# EasyEDA Pro project Solar-Module_25-3-9.epro

# Schematic Schematic1
Board Name: 44x24_5.5V; Create Date: 2024-12-06; Page Name: P1; Project Name: Solar-Module; Schematic Name: Schematic1; Update Date: 2024-12-10; Company: 嘉立创EDA; Page Size: A4; Version: V1.0
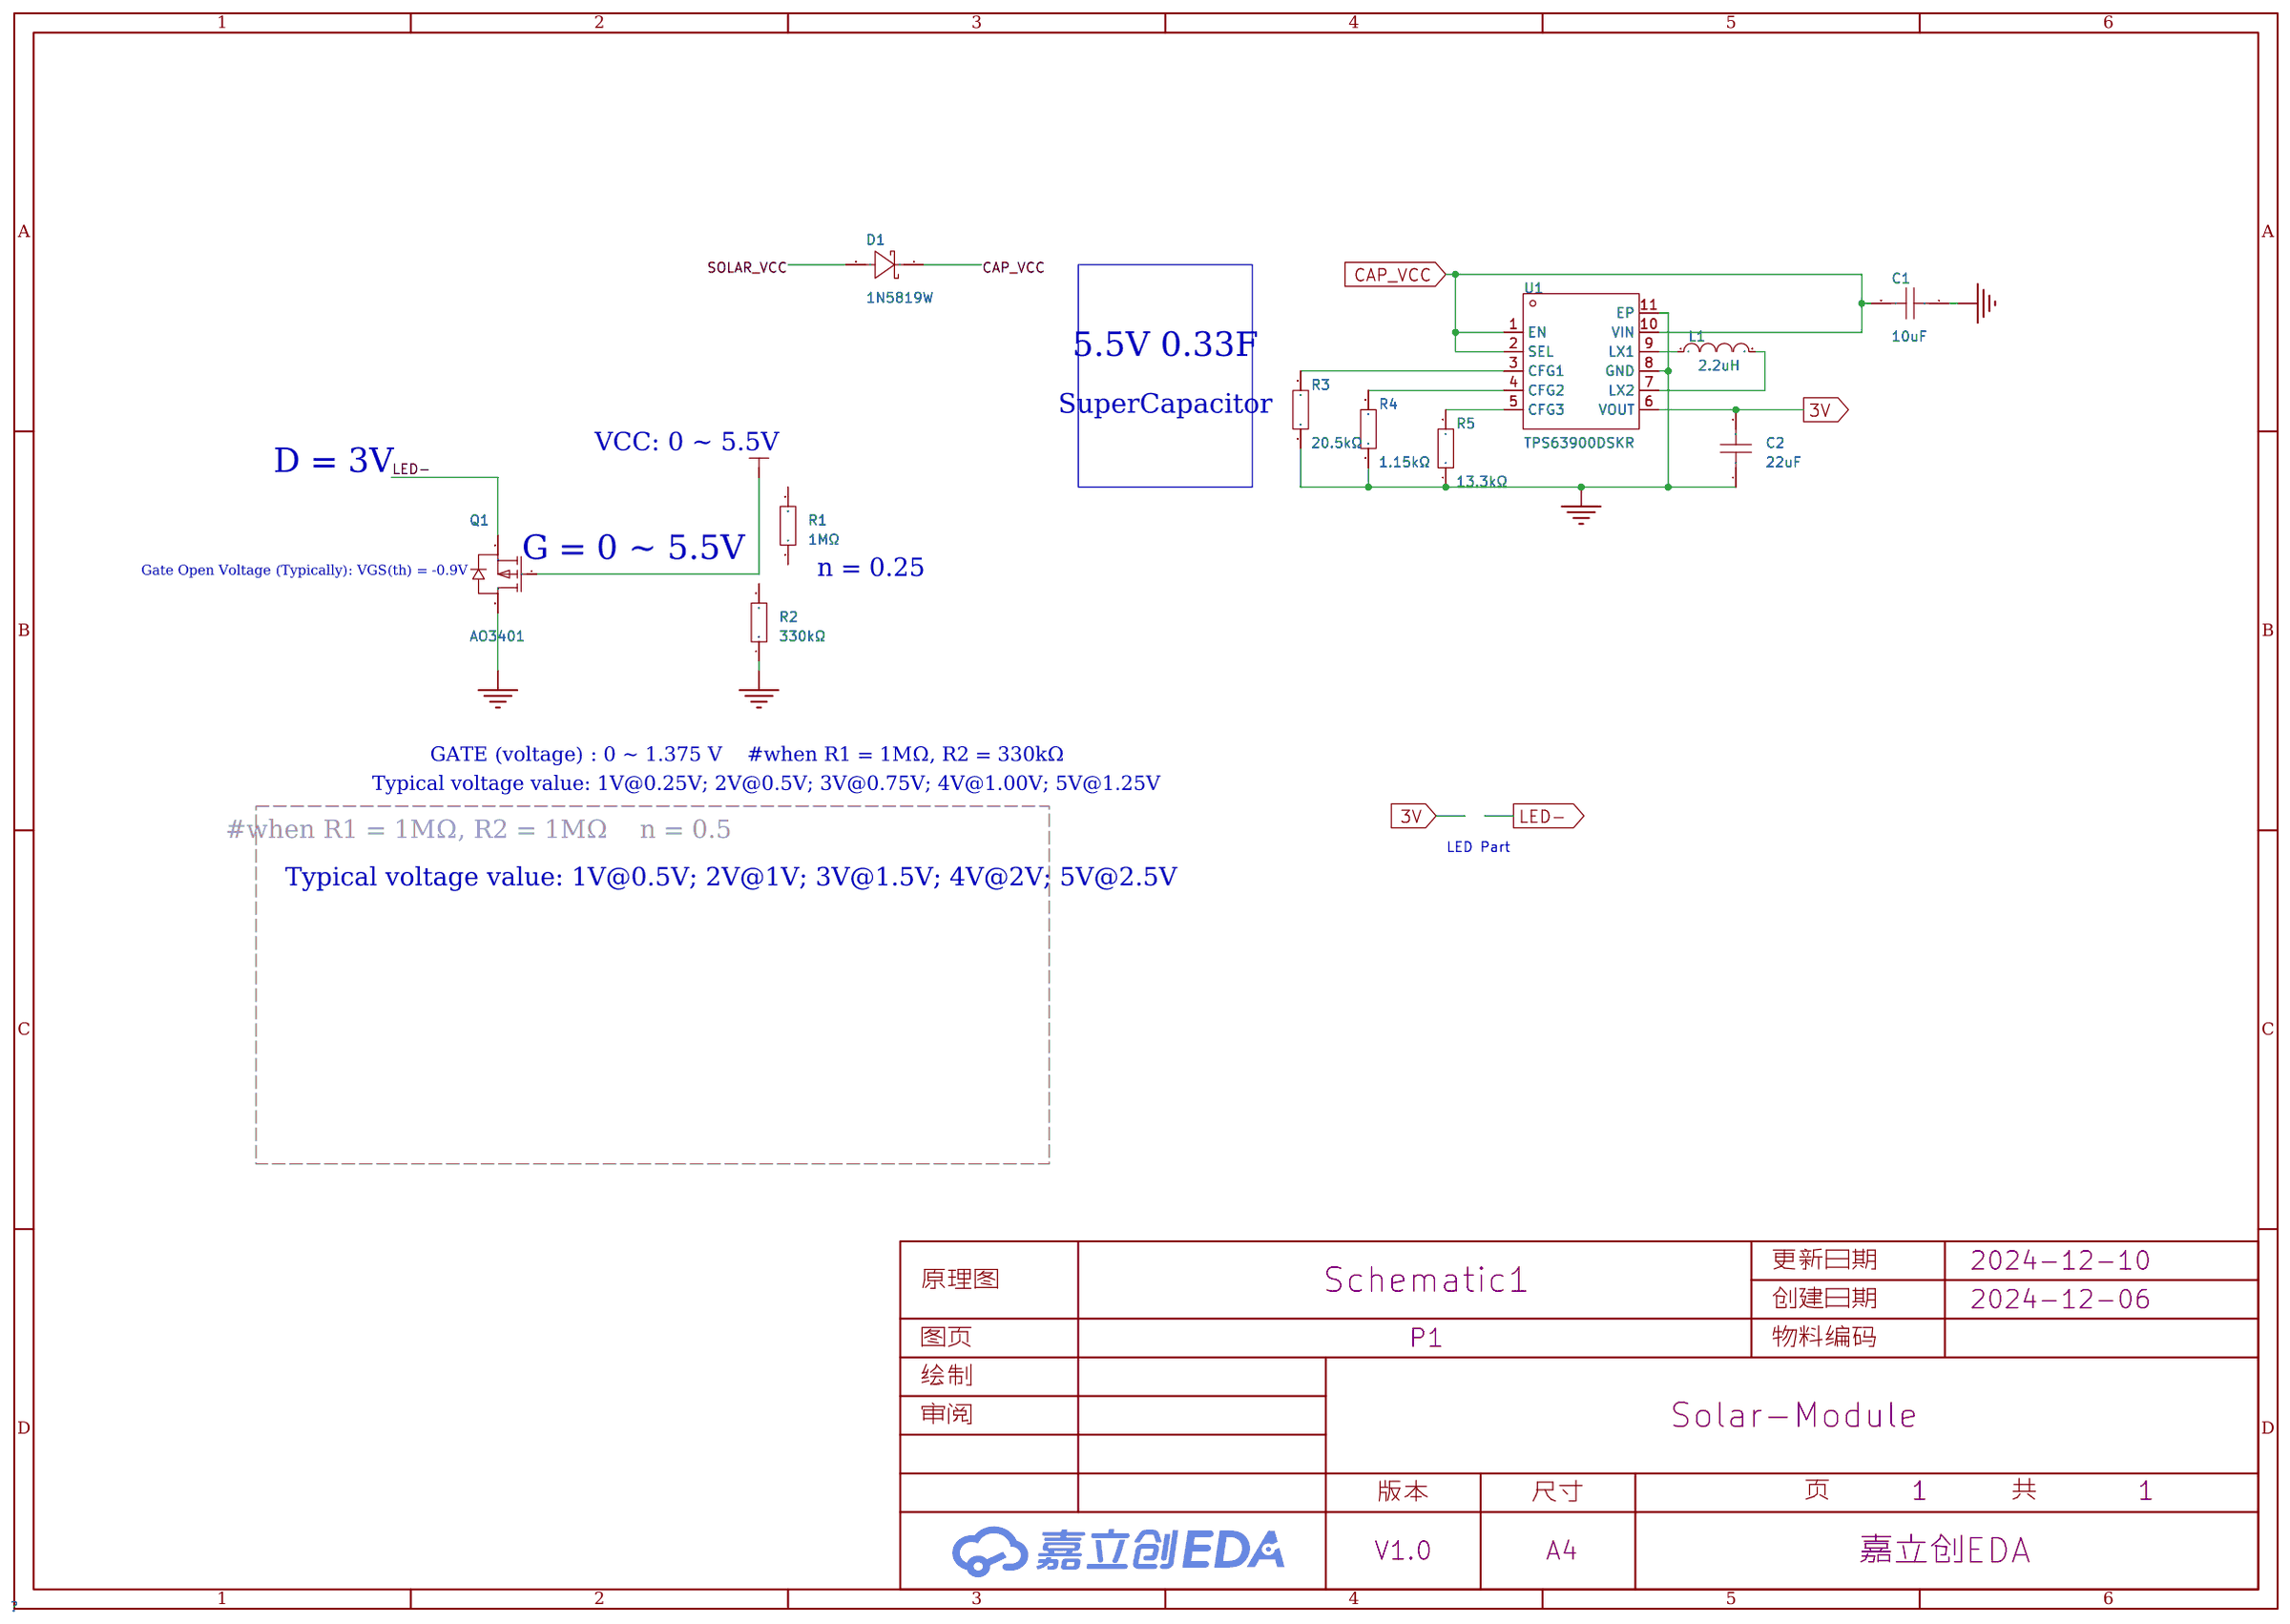
[diagram p0: schematic sheet]

## Parts
C1  10uF  [C0805]
C2  22uF  [C0805]
D1  1N5819W  [SOD-123_L2.8-W1.8-LS3.7-RD]
L1  2.2uH  [IND-SMD_L2.5-W2.0-VLS252012CX-150M]
Q1  AO3401  [SOT-23-3_L2.9-W1.4-P1.90-LS2.6-BR]
R1  1MΩ  [R0603]
R2  330kΩ  [R0603]
R3  20.5kΩ  [R0603]
R4  1.15kΩ  [R0603]
R5  13.3kΩ  [R0603]
U1  TPS63900DSKR  [WSON-10_L2.5-W2.5-W0.50-TL-EP]

## Library data of the parts
C1 = CL21A106KAYNNNE_C15850: 容值:10uF;精度:±10%;额定电压:25V;材质(温度系数):X5R;; LCSC Part Name: 10uF ±10% 25V; Supplier Part: C15850; Manufacturer: SAMSUNG(三星); Manufacturer Part: CL21A106KAYNNNE; Supplier Footprint: 0805; JLCPCB Part Class: 基础库; Datasheet: https://atta.szlcsc.com/upload/public/pdf/source/20160218/1457707763339.pdf; Supplier: LCSC; Tolerance: ±10%; Voltage Rated: 25V; Temperature Coefficient: X5R
C2 = CL21A226MAQNNNE: 容值:22uF;精度:±20%;额定电压:25V;材质(温度系数):X5R;; LCSC Part Name: 22uF ±20% 25V; Supplier Part: C45783; Manufacturer: SAMSUNG(三星); Supplier Footprint: 0805; JLCPCB Part Class: 基础库; Datasheet: https://atta.szlcsc.com/upload/public/pdf/source/20160218/1457707763339.pdf; Supplier: LCSC; Tolerance: ±20%; Voltage Rated: 25V; Temperature Coefficient: X5R
D1 = 1N5819W_C727115: 二极管配置:独立式;正向压降(Vf):900mV@3A;直流反向耐压(Vr):40V;整流电流:1A;; LCSC Part Name: 电压:40V 电流:1A; Supplier Part: C727115; Manufacturer: TWGMC(台湾迪嘉); Supplier Footprint: SOD-123; JLCPCB Part Class: 扩展库; Datasheet: https://atta.szlcsc.com/upload/public/pdf/source/20220518/A32FD9482A1BC542ED9C09095620CB64.pdf; Supplier: LCSC; Diode Configuration: 独立式; Forward Voltage (Vf@If): 900mV@3A; Reverse Voltage (Vr): 40V; Rectified Current: 1A; Reverse Leakage Current (Ir): 1mA
L1 = VLS252012CX-2R2M: 电感值:2.2uH;精度:±20%;额定电流:1.76A;; LCSC Part Name: 2.2uH ±20% 停产; Supplier Part: C307867; Manufacturer: TDK; Supplier Footprint: 2520; JLCPCB Part Class: Extended Part; Datasheet: https://atta.szlcsc.com/upload/public/pdf/source/20200727/C307867_825634F56BDB10F5BF665C183AF56530.pdf; Supplier: LCSC; Tolerance: ±20%; Rated Current: 1.76A; DC Resistance (DCR): 80mΩ
Q1 = AO3401_C727156: 类型:1个P沟道;漏源电压(Vdss):30V;连续漏极电流(Id):4.2A;导通电阻(RDS(on)@Vgs,Id):65mΩ@10V,4.2A;功率(Pd):350mW;阈值电压(Vgs(th)@Id):1.3V@250uA;; LCSC Part Name: 1个P沟道 耐压:30V 电流:4.2A; Supplier Part: C727156; Manufacturer: TWGMC(台湾迪嘉); Supplier Footprint: SOT-23; JLCPCB Part Class: 扩展库; Datasheet: https://atta.szlcsc.com/upload/public/pdf/source/20200827/C727156_6E081BBEEFBC6B8FEE164CB196B0AF30.pdf; Supplier: LCSC; Type: 1个P沟道; Drain Source Voltage (Vdss): 30V; Continuous Drain Current (Id): 4.2A; Drain Source On Resistance (RDS(on)@Vgs,Id): 65mΩ@10V,4.2A; Power Dissipation (Pd): 350mW; Gate Threshold Voltage (Vgs(th)@Id): 1.3V@250uA; Input Capacitance (Ciss@Vds): 954pF; Reverse Transfer Capacitance (Crss@Vds): 77pF; Operating Temperature: -55℃~+150℃
R1 = 0603WAF1004T5E: 电阻类型:厚膜电阻;阻值:1MΩ;精度:±1%;功率:100mW;最大工作电压:75V;温度系数:±100ppm/℃;; LCSC Part Name: 1MΩ ±1% 100mW 厚膜电阻; Supplier Part: C22935; Manufacturer: UNI-ROYAL(厚声); Supplier Footprint: 0603; JLCPCB Part Class: 基础库; Datasheet: https://atta.szlcsc.com/upload/public/pdf/source/20200306/C422600_1E6D84923E4A46A82E41ADD87F860B5C.pdf; Supplier: LCSC; Type: 厚膜电阻; Tolerance: ±1%; Power(Watts): 100mW; Overload Voltage (Max): 75V; Temperature Coefficient: ±100ppm/℃; Operating Temperature Range: -55℃~+155℃
R2 = 0603WAF3303T5E: 电阻类型:厚膜电阻;阻值:330kΩ;精度:±1%;功率:100mW;最大工作电压:75V;温度系数:±100ppm/℃;; LCSC Part Name: 330kΩ ±1% 100mW 厚膜电阻; Supplier Part: C23137; Manufacturer: UNI-ROYAL(厚声); Supplier Footprint: 0603; JLCPCB Part Class: 基础库; Datasheet: https://atta.szlcsc.com/upload/public/pdf/source/20200306/C422600_1E6D84923E4A46A82E41ADD87F860B5C.pdf; Supplier: LCSC; Type: 厚膜电阻; Tolerance: ±1%; Power(Watts): 100mW; Overload Voltage (Max): 75V; Temperature Coefficient: ±100ppm/℃; Operating Temperature Range: -55℃~+155℃
R3 = 0603WAF2052T5E: 电阻类型:厚膜电阻;阻值:20.5kΩ;精度:±1%;功率:100mW;最大工作电压:75V;温度系数:±100ppm/℃;; LCSC Part Name: 20.5kΩ ±1% 100mW 厚膜电阻; Supplier Part: C22910; Manufacturer: UNI-ROYAL(厚声); Supplier Footprint: 0603; JLCPCB Part Class: 扩展库; Datasheet: https://atta.szlcsc.com/upload/public/pdf/source/20200306/C422600_1E6D84923E4A46A82E41ADD87F860B5C.pdf; Supplier: LCSC; Type: 厚膜电阻; Tolerance: ±1%; Power(Watts): 100mW; Overload Voltage (Max): 75V; Temperature Coefficient: ±100ppm/℃; Operating Temperature Range: -55℃~+155℃
R4 = 0603WAF1151T5E: 电阻类型:厚膜电阻;阻值:1.15kΩ;精度:±1%;功率:100mW;最大工作电压:75V;温度系数:±100ppm/℃;; LCSC Part Name: 1.15kΩ ±1% 100mW 厚膜电阻; Supplier Part: C22834; Manufacturer: UNI-ROYAL(厚声); Supplier Footprint: 0603; JLCPCB Part Class: 扩展库; Datasheet: https://atta.szlcsc.com/upload/public/pdf/source/20200306/C422600_1E6D84923E4A46A82E41ADD87F860B5C.pdf; Supplier: LCSC; Type: 厚膜电阻; Tolerance: ±1%; Power(Watts): 100mW; Overload Voltage (Max): 75V; Temperature Coefficient: ±100ppm/℃; Operating Temperature Range: -55℃~+155℃
R5 = 0603WAF1332T5E: 电阻类型:厚膜电阻;阻值:13.3kΩ;精度:±1%;功率:100mW;最大工作电压:75V;温度系数:±100ppm/℃;; LCSC Part Name: 13.3kΩ ±1% 100mW 厚膜电阻; Supplier Part: C25952; Manufacturer: UNI-ROYAL(厚声); Supplier Footprint: 0603; JLCPCB Part Class: 扩展库; Datasheet: https://atta.szlcsc.com/upload/public/pdf/source/20200306/C422600_1E6D84923E4A46A82E41ADD87F860B5C.pdf; Supplier: LCSC; Type: 厚膜电阻; Tolerance: ±1%; Power(Watts): 100mW; Overload Voltage (Max): 75V; Temperature Coefficient: ±100ppm/℃; Operating Temperature Range: -55℃~+155℃
U1 = TPS63900DSKR: 输入电压:1.8V~5.5V;输出电流:400mA;; LCSC Part Name: 1.8V至5.5V,75nA超低静态电流同步升降压转换器; Supplier Part: C1518762; Manufacturer: TI(德州仪器); Supplier Footprint: WSON-10-EP(2.5x2.5); JLCPCB Part Class: 扩展库; Datasheet: https://www.ti.com/cn/lit/gpn/tps63900; Supplier: LCSC; Input Voltage: 1.8V~5.5V; Output Current: 400mA; Operating Temperature: -40℃~+125℃@(TJ); Synchronous Rectification: 是; Topology: 降压-升压式

## Nets
3V: C2.2 U1.6(VOUT)
GND: C1.1 C2.1 Q1.3(D) R2.1 R3.1 R4.1 R5.1 U1.8(GND) U1.11(EP)
CAP_VCC: C1.2 D1.1(C) U1.1(EN) U1.2(SEL) U1.10(VIN)
LED-: Q1.2(S)
SOLAR_VCC: D1.2(A) Q1.1(G)
$1N1286: L1.1 U1.9(LX1)
$1N1290: L1.2 U1.7(LX2)
$1N1305: R3.2 U1.3(CFG1)
$1N1309: R4.2 U1.4(CFG2)
$1N1314: R5.2 U1.5(CFG3)

Not connected (* = marked no-connect by the designer): R1 1 2; R2 2

## Notes on the sheet
- 5.5V 0.33F
- SuperCapacitor
- VCC: 0 ~ 5.5V
- D = 3V
- G = 0 ~ 5.5V
- Gate Open Voltage (Typically): VGS(th) = -0.9V
- n = 0.25
- GATE (voltage) : 0 ~ 1.375 V    #when R1 = 1MΩ, R2 = 330kΩ
- Typical voltage value: 1V@0.25V; 2V@0.5V; 3V@0.75V; 4V@1.00V; 5V@1.25V
- #when R1 = 1MΩ, R2 = 1MΩ    n = 0.5
- LED Part
- Typical voltage value: 1V@0.5V; 2V@1V; 3V@1.5V; 4V@2V; 5V@2.5V

# Schematic Schematic1_2
Board Name: 44x24_5.5V_(Beta.2); Create Date: 2024-12-16; Page Name: P1; Project Name: Solar-Module; Schematic Name: Schematic1_2; Update Date: 2024-12-19; Company: 嘉立创EDA; Page Size: A4; Version: V1.0
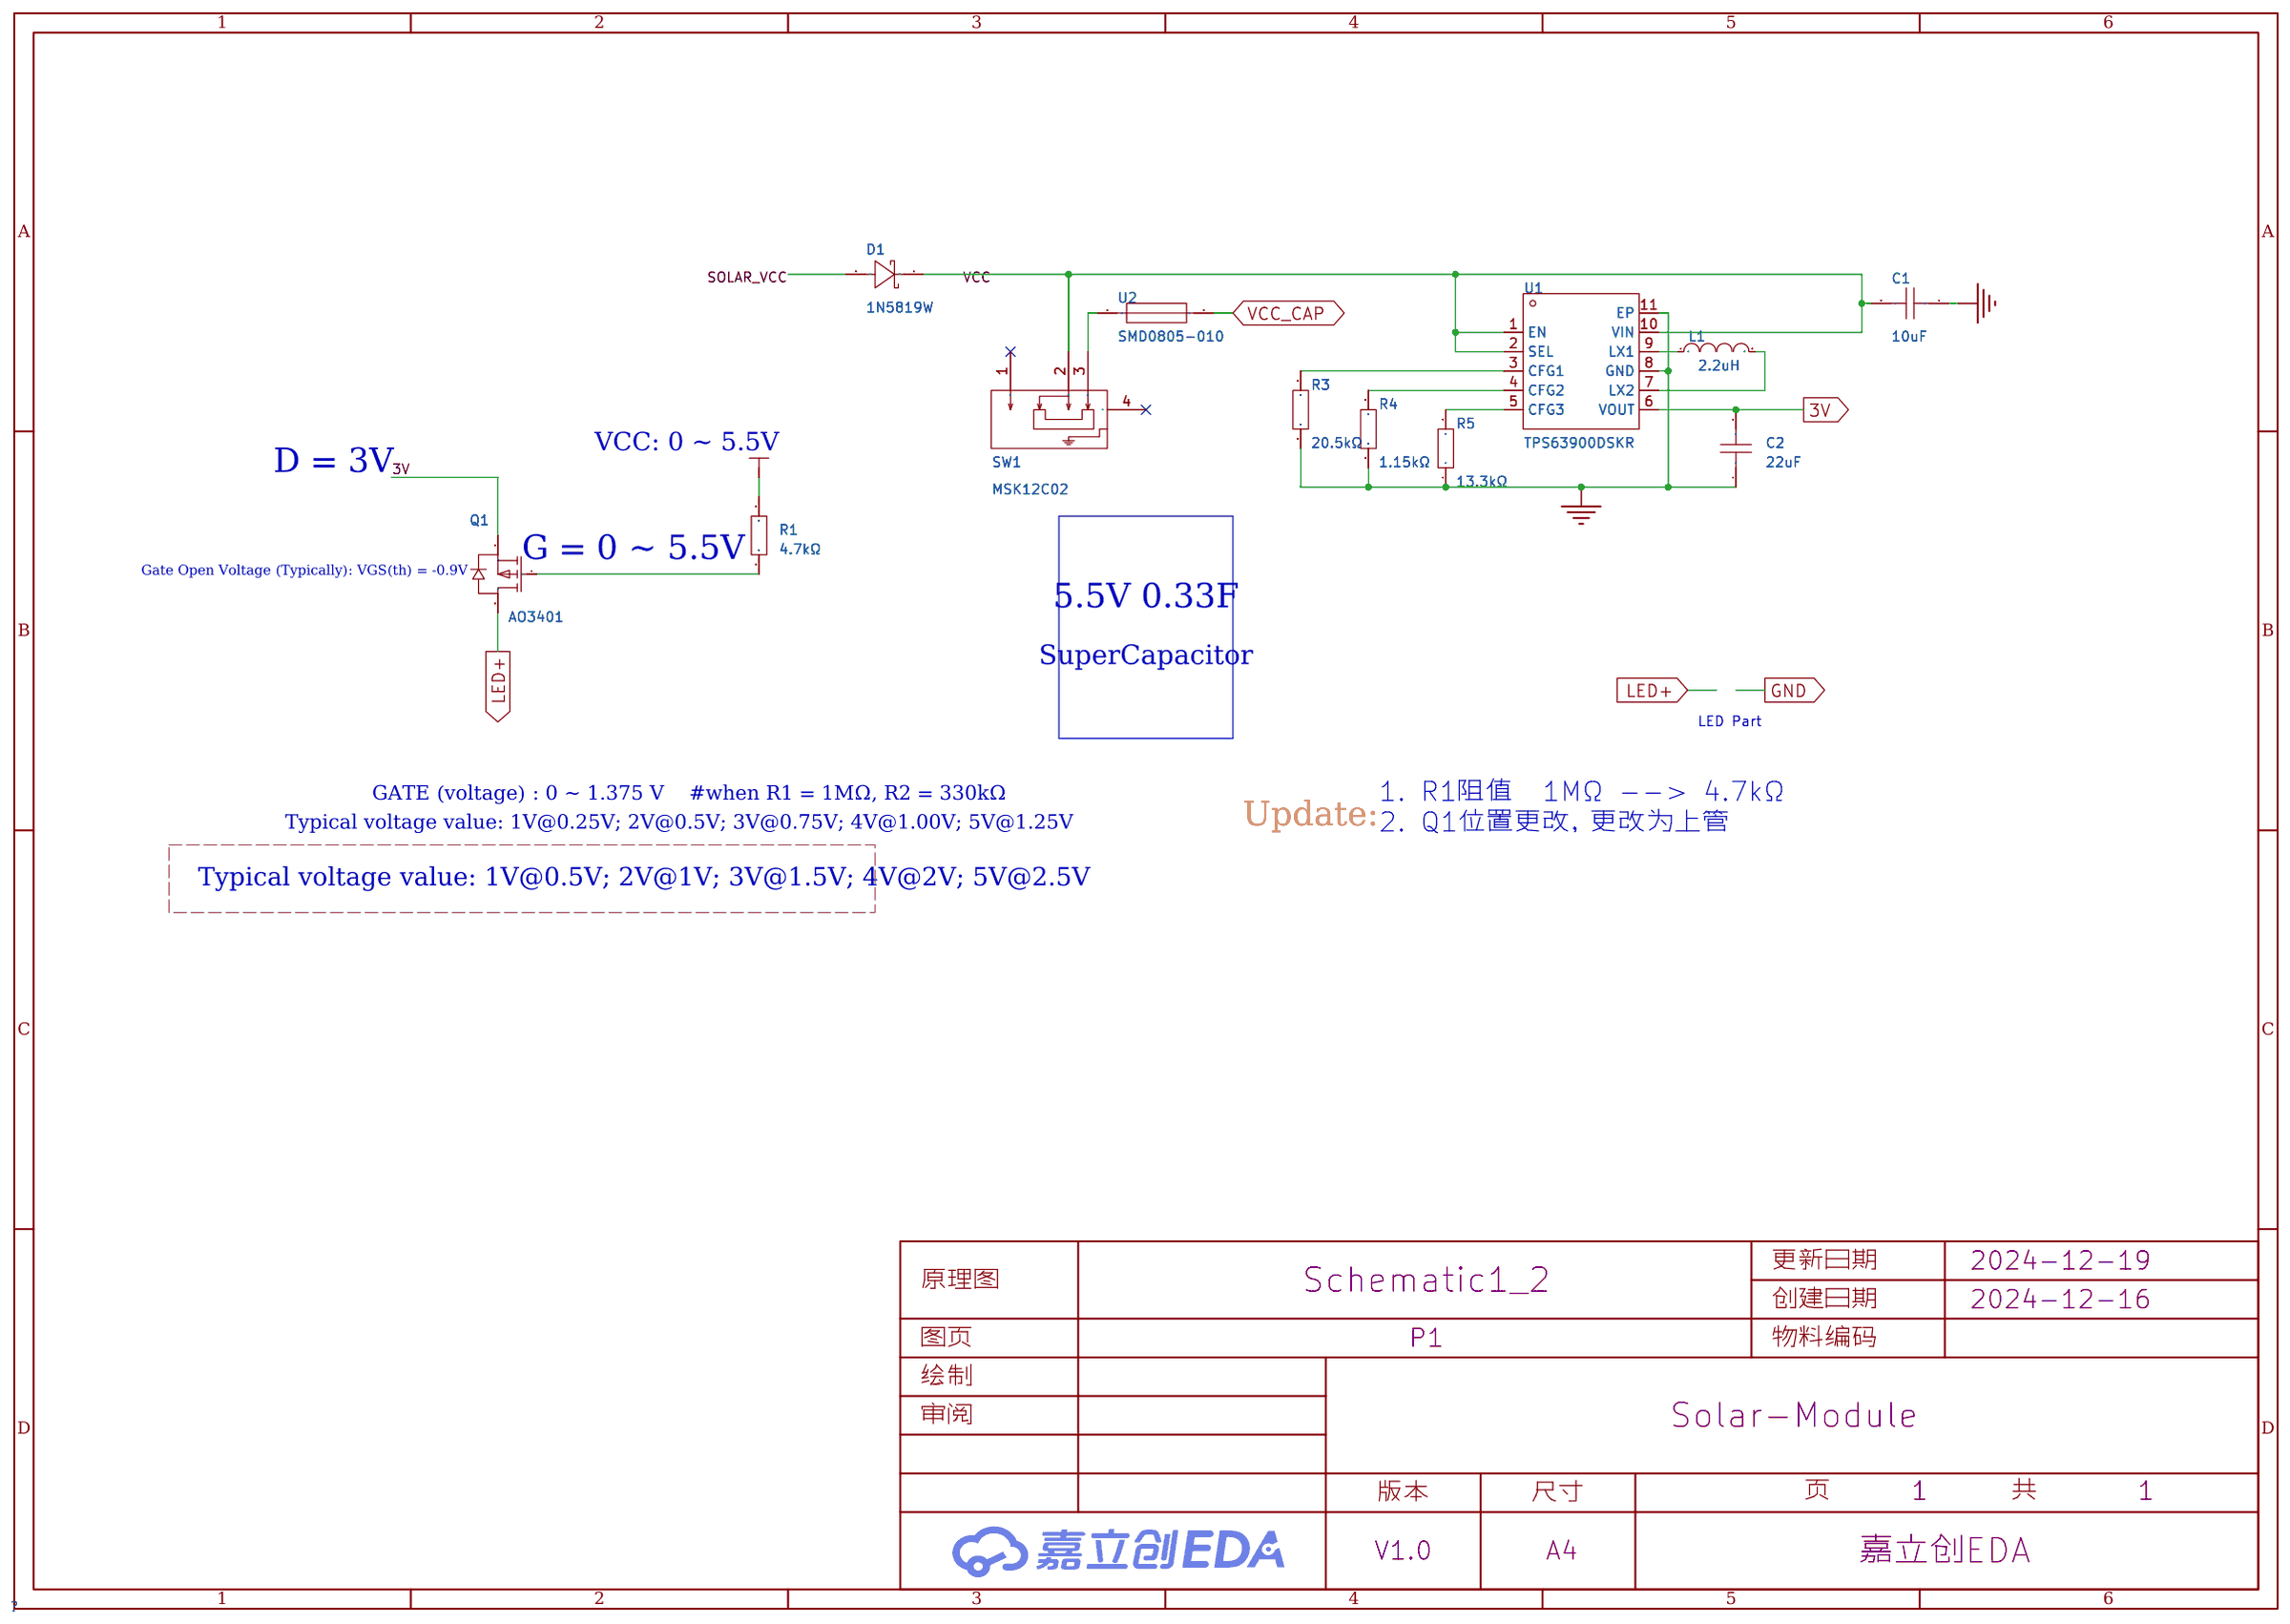
[diagram p1: schematic sheet]

## Parts
C1  10uF  [C0805]
C2  22uF  [C0805]
D1  1N5819W  [SOD-123_L2.8-W1.8-LS3.7-RD]
L1  2.2uH  [IND-SMD_L2.5-W2.0-VLS252012CX-150M]
Q1  AO3401  [SOT-23-3_L2.9-W1.4-P1.90-LS2.6-BR]
R1  4.7kΩ  [R0603]
R3  20.5kΩ  [R0603]
R4  1.15kΩ  [R0603]
R5  13.3kΩ  [R0603]
SW1  MSK12C02  [SW-TH_MSK12C02]
U1  TPS63900DSKR  [WSON-10_L2.5-W2.5-W0.50-TL-EP]
U2  SMD0805-010  [F0805]

## Library data of the parts
C1 = CL21A106KAYNNNE_C15850: 容值:10uF;精度:±10%;额定电压:25V;材质(温度系数):X5R;; LCSC Part Name: 10uF ±10% 25V; Supplier Part: C15850; Manufacturer: SAMSUNG(三星); Manufacturer Part: CL21A106KAYNNNE; Supplier Footprint: 0805; JLCPCB Part Class: 基础库; Datasheet: https://atta.szlcsc.com/upload/public/pdf/source/20160218/1457707763339.pdf; Supplier: LCSC; Tolerance: ±10%; Voltage Rated: 25V; Temperature Coefficient: X5R
C2 = CL21A226MAQNNNE: 容值:22uF;精度:±20%;额定电压:25V;材质(温度系数):X5R;; LCSC Part Name: 22uF ±20% 25V; Supplier Part: C45783; Manufacturer: SAMSUNG(三星); Supplier Footprint: 0805; JLCPCB Part Class: 基础库; Datasheet: https://atta.szlcsc.com/upload/public/pdf/source/20160218/1457707763339.pdf; Supplier: LCSC; Tolerance: ±20%; Voltage Rated: 25V; Temperature Coefficient: X5R
D1 = 1N5819W_C727115: 二极管配置:独立式;正向压降(Vf):900mV@3A;直流反向耐压(Vr):40V;整流电流:1A;; LCSC Part Name: 电压:40V 电流:1A; Supplier Part: C727115; Manufacturer: TWGMC(台湾迪嘉); Supplier Footprint: SOD-123; JLCPCB Part Class: 扩展库; Datasheet: https://atta.szlcsc.com/upload/public/pdf/source/20220518/A32FD9482A1BC542ED9C09095620CB64.pdf; Supplier: LCSC; Diode Configuration: 独立式; Forward Voltage (Vf@If): 900mV@3A; Reverse Voltage (Vr): 40V; Rectified Current: 1A; Reverse Leakage Current (Ir): 1mA
L1 = VLS252012CX-2R2M: 电感值:2.2uH;精度:±20%;额定电流:1.76A;; LCSC Part Name: 2.2uH ±20% 停产; Supplier Part: C307867; Manufacturer: TDK; Supplier Footprint: 2520; JLCPCB Part Class: Extended Part; Datasheet: https://atta.szlcsc.com/upload/public/pdf/source/20200727/C307867_825634F56BDB10F5BF665C183AF56530.pdf; Supplier: LCSC; Tolerance: ±20%; Rated Current: 1.76A; DC Resistance (DCR): 80mΩ
Q1 = AO3401_C727156: 类型:1个P沟道;漏源电压(Vdss):30V;连续漏极电流(Id):4.2A;导通电阻(RDS(on)@Vgs,Id):65mΩ@10V,4.2A;功率(Pd):350mW;阈值电压(Vgs(th)@Id):1.3V@250uA;; LCSC Part Name: 1个P沟道 耐压:30V 电流:4.2A; Supplier Part: C727156; Manufacturer: TWGMC(台湾迪嘉); Supplier Footprint: SOT-23; JLCPCB Part Class: 扩展库; Datasheet: https://atta.szlcsc.com/upload/public/pdf/source/20200827/C727156_6E081BBEEFBC6B8FEE164CB196B0AF30.pdf; Supplier: LCSC; Type: 1个P沟道; Drain Source Voltage (Vdss): 30V; Continuous Drain Current (Id): 4.2A; Drain Source On Resistance (RDS(on)@Vgs,Id): 65mΩ@10V,4.2A; Power Dissipation (Pd): 350mW; Gate Threshold Voltage (Vgs(th)@Id): 1.3V@250uA; Input Capacitance (Ciss@Vds): 954pF; Reverse Transfer Capacitance (Crss@Vds): 77pF; Operating Temperature: -55℃~+150℃
R1 = 0603WAF4701T5E: 电阻类型:厚膜电阻;阻值:4.7kΩ;精度:±1%;功率:100mW;最大工作电压:75V;温度系数:±100ppm/℃;; LCSC Part Name: 4.7kΩ ±1% 100mW 厚膜电阻; Supplier Part: C23162; Manufacturer: UNI-ROYAL(厚声); Supplier Footprint: 0603; JLCPCB Part Class: Basic Part; Datasheet: https://atta.szlcsc.com/upload/public/pdf/source/20200306/C422600_1E6D84923E4A46A82E41ADD87F860B5C.pdf; Supplier: LCSC; Type: 厚膜电阻; Tolerance: ±1%; Power(Watts): 100mW; Overload Voltage (Max): 75V; Temperature Coefficient: ±100ppm/℃; Operating Temperature Range: -55℃~+155℃
R3 = 0603WAF2052T5E: 电阻类型:厚膜电阻;阻值:20.5kΩ;精度:±1%;功率:100mW;最大工作电压:75V;温度系数:±100ppm/℃;; LCSC Part Name: 20.5kΩ ±1% 100mW 厚膜电阻; Supplier Part: C22910; Manufacturer: UNI-ROYAL(厚声); Supplier Footprint: 0603; JLCPCB Part Class: 扩展库; Datasheet: https://atta.szlcsc.com/upload/public/pdf/source/20200306/C422600_1E6D84923E4A46A82E41ADD87F860B5C.pdf; Supplier: LCSC; Type: 厚膜电阻; Tolerance: ±1%; Power(Watts): 100mW; Overload Voltage (Max): 75V; Temperature Coefficient: ±100ppm/℃; Operating Temperature Range: -55℃~+155℃
R4 = 0603WAF1151T5E: 电阻类型:厚膜电阻;阻值:1.15kΩ;精度:±1%;功率:100mW;最大工作电压:75V;温度系数:±100ppm/℃;; LCSC Part Name: 1.15kΩ ±1% 100mW 厚膜电阻; Supplier Part: C22834; Manufacturer: UNI-ROYAL(厚声); Supplier Footprint: 0603; JLCPCB Part Class: 扩展库; Datasheet: https://atta.szlcsc.com/upload/public/pdf/source/20200306/C422600_1E6D84923E4A46A82E41ADD87F860B5C.pdf; Supplier: LCSC; Type: 厚膜电阻; Tolerance: ±1%; Power(Watts): 100mW; Overload Voltage (Max): 75V; Temperature Coefficient: ±100ppm/℃; Operating Temperature Range: -55℃~+155℃
R5 = 0603WAF1332T5E: 电阻类型:厚膜电阻;阻值:13.3kΩ;精度:±1%;功率:100mW;最大工作电压:75V;温度系数:±100ppm/℃;; LCSC Part Name: 13.3kΩ ±1% 100mW 厚膜电阻; Supplier Part: C25952; Manufacturer: UNI-ROYAL(厚声); Supplier Footprint: 0603; JLCPCB Part Class: 扩展库; Datasheet: https://atta.szlcsc.com/upload/public/pdf/source/20200306/C422600_1E6D84923E4A46A82E41ADD87F860B5C.pdf; Supplier: LCSC; Type: 厚膜电阻; Tolerance: ±1%; Power(Watts): 100mW; Overload Voltage (Max): 75V; Temperature Coefficient: ±100ppm/℃; Operating Temperature Range: -55℃~+155℃
SW1 = MSK12C02: 电路结构:单刀双掷;安装方式:卧贴;开关颜色:-;额定电流(DC):50mA;额定电压(DC):12V;额定电流(AC):-;额定电压(AC):-;机械寿命:1万次;; LCSC Part Name: 两档侧拨贴片 7脚 滑动开关; Supplier Part: C431540; Manufacturer: SHOU HAN(首韩); Supplier Footprint: SMD; JLCPCB Part Class: 扩展库; Datasheet: https://atta.szlcsc.com/upload/public/pdf/source/20190925/C431540_89155AEF0758B9AD1B2D805F83FB12E3.pdf; Supplier: LCSC; Circuit: 单刀双掷; Pin Style: SMD接片; Switch Length: 8mm; Switch Width: 2.8mm; Switch Height: 1.4mm; Mounting Style: 卧贴; Current Rating (DC): 50mA; Voltage Rating (DC): 12V; Mechanical Life: 1万次; Operating Temperature: -20℃~+70℃
U1 = TPS63900DSKR: 输入电压:1.8V~5.5V;输出电流:400mA;; LCSC Part Name: 1.8V至5.5V,75nA超低静态电流同步升降压转换器; Supplier Part: C1518762; Manufacturer: TI(德州仪器); Supplier Footprint: WSON-10-EP(2.5x2.5); JLCPCB Part Class: 扩展库; Datasheet: https://www.ti.com/cn/lit/gpn/tps63900; Supplier: LCSC; Input Voltage: 1.8V~5.5V; Output Current: 400mA; Operating Temperature: -40℃~+125℃@(TJ); Synchronous Rectification: 是; Topology: 降压-升压式
U2 = SMD0805-010: 最大电压:15V;最大电流:100A;保持电流:100mA;跳闸电流:300mA;; LCSC Part Name: 15V 100mA 0805自恢复; Supplier Part: C70054; Manufacturer: 台湾陆海; Supplier Footprint: 0805; JLCPCB Part Class: Extended Part; Datasheet: https://atta.szlcsc.com/upload/public/pdf/source/20160331/1459396375918.pdf; Supplier: LCSC; Operating Voltage (Max): 15V; Current Rating (Max): 100A; Hold Current: 100mA; Trip Current: 300mA

## Nets
3V: C2.2 Q1.2(S) U1.6(VOUT)
GND: C1.1 C2.1 R3.1 R4.1 R5.1 U1.8(GND) U1.11(EP)
VCC: C1.2 D1.1(C) SW1.2 U1.1(EN) U1.2(SEL) U1.10(VIN)
VCC_CAP: U2.2
LED+: Q1.3(D)
SOLAR_VCC: D1.2(A) R1.2
$1N1286: L1.1 U1.9(LX1)
$1N1290: L1.2 U1.7(LX2)
$1N1305: R3.2 U1.3(CFG1)
$1N1309: R4.2 U1.4(CFG2)
$1N1314: R5.2 U1.5(CFG3)
$1N3593: Q1.1(G) R1.1
$1N4546: SW1.3 U2.1

Not connected (* = marked no-connect by the designer): SW1 1* 4*

## Notes on the sheet
- VCC: 0 ~ 5.5V
- D = 3V
- G = 0 ~ 5.5V
- Gate Open Voltage (Typically): VGS(th) = -0.9V
- 5.5V 0.33F
- SuperCapacitor
- LED Part
- GATE (voltage) : 0 ~ 1.375 V    #when R1 = 1MΩ, R2 = 330kΩ
- Typical voltage value: 1V@0.25V; 2V@0.5V; 3V@0.75V; 4V@1.00V; 5V@1.25V
- Update:
- 1. R1阻值  1MΩ --> 4.7kΩ
  2. Q1位置更改，更改为上管
- Typical voltage value: 1V@0.5V; 2V@1V; 3V@1.5V; 4V@2V; 5V@2.5V

# Schematic Schematic1_3
Board Name: 44x24_5.5V_(Beta.3.1); Create Date: 2025-01-12; Page Name: P1; Project Name: Solar-Module; Schematic Name: Schematic1_3; Update Date: 2025-03-09; Company: 嘉立创EDA; Page Size: A4; Version: V1.0
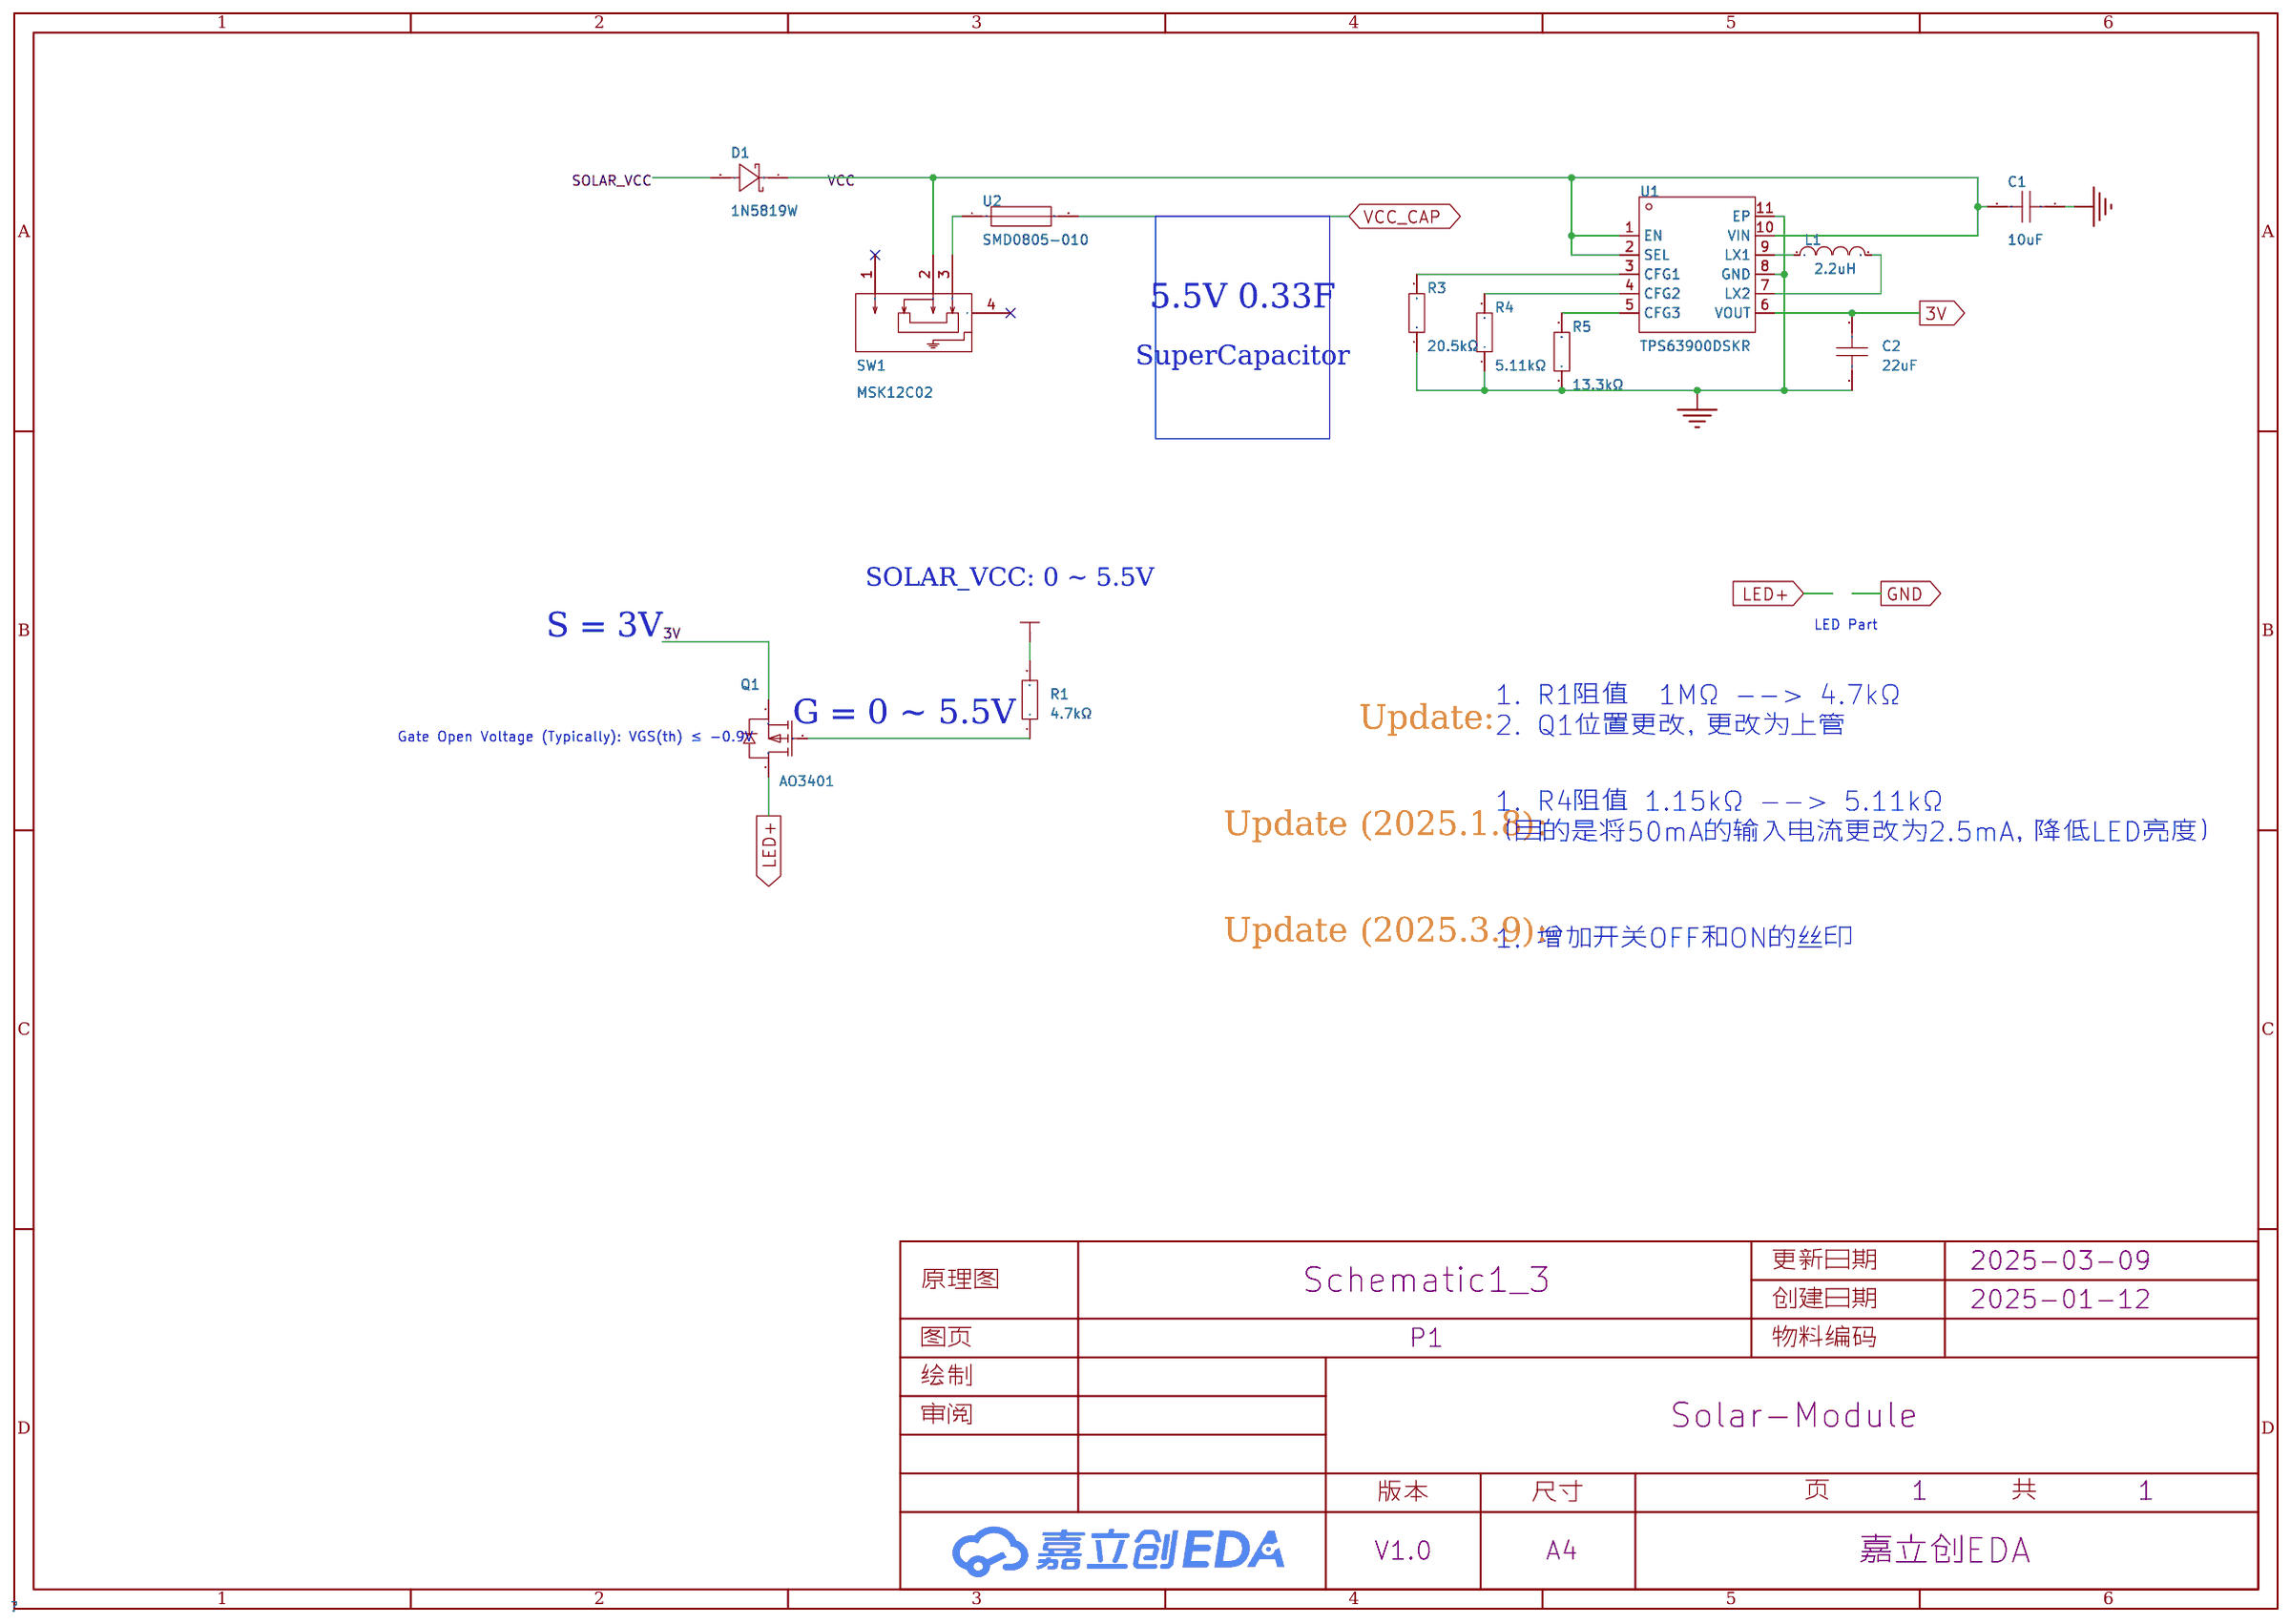
[diagram p2: schematic sheet]

## Parts
C1  10uF  [C0805]
C2  22uF  [C0805]
D1  1N5819W  [SOD-123_L2.8-W1.8-LS3.7-RD]
L1  2.2uH  [IND-SMD_L2.5-W2.0-VLS252012CX-150M]
Q1  AO3401  [SOT-23-3_L2.9-W1.4-P1.90-LS2.6-BR]
R1  4.7kΩ  [R0603]
R3  20.5kΩ  [R0603]
R4  5.11kΩ  [R0603]
R5  13.3kΩ  [R0603]
SW1  MSK12C02  [SW-TH_MSK12C02]
U1  TPS63900DSKR  [WSON-10_L2.5-W2.5-W0.50-TL-EP]
U2  SMD0805-010  [F0805]

## Library data of the parts
C1 = CL21A106KAYNNNE_C15850: 容值:10uF;精度:±10%;额定电压:25V;材质(温度系数):X5R;; LCSC Part Name: 10uF ±10% 25V; Supplier Part: C15850; Manufacturer: SAMSUNG(三星); Manufacturer Part: CL21A106KAYNNNE; Supplier Footprint: 0805; JLCPCB Part Class: 基础库; Datasheet: https://atta.szlcsc.com/upload/public/pdf/source/20160218/1457707763339.pdf; Supplier: LCSC; Tolerance: ±10%; Voltage Rated: 25V; Temperature Coefficient: X5R
C2 = CL21A226MAQNNNE: 容值:22uF;精度:±20%;额定电压:25V;材质(温度系数):X5R;; LCSC Part Name: 22uF ±20% 25V; Supplier Part: C45783; Manufacturer: SAMSUNG(三星); Supplier Footprint: 0805; JLCPCB Part Class: 基础库; Datasheet: https://atta.szlcsc.com/upload/public/pdf/source/20160218/1457707763339.pdf; Supplier: LCSC; Tolerance: ±20%; Voltage Rated: 25V; Temperature Coefficient: X5R
D1 = 1N5819W_C727115: 二极管配置:独立式;正向压降(Vf):900mV@3A;直流反向耐压(Vr):40V;整流电流:1A;; LCSC Part Name: 电压:40V 电流:1A; Supplier Part: C727115; Manufacturer: TWGMC(台湾迪嘉); Supplier Footprint: SOD-123; JLCPCB Part Class: 扩展库; Datasheet: https://atta.szlcsc.com/upload/public/pdf/source/20220518/A32FD9482A1BC542ED9C09095620CB64.pdf; Supplier: LCSC; Diode Configuration: 独立式; Forward Voltage (Vf@If): 900mV@3A; Reverse Voltage (Vr): 40V; Rectified Current: 1A; Reverse Leakage Current (Ir): 1mA
L1 = VLS252012CX-2R2M: 电感值:2.2uH;精度:±20%;额定电流:1.76A;; LCSC Part Name: 2.2uH ±20% 停产; Supplier Part: C307867; Manufacturer: TDK; Supplier Footprint: 2520; JLCPCB Part Class: Extended Part; Datasheet: https://atta.szlcsc.com/upload/public/pdf/source/20200727/C307867_825634F56BDB10F5BF665C183AF56530.pdf; Supplier: LCSC; Tolerance: ±20%; Rated Current: 1.76A; DC Resistance (DCR): 80mΩ
Q1 = AO3401_C727156: 类型:1个P沟道;漏源电压(Vdss):30V;连续漏极电流(Id):4.2A;导通电阻(RDS(on)@Vgs,Id):65mΩ@10V,4.2A;功率(Pd):350mW;阈值电压(Vgs(th)@Id):1.3V@250uA;; LCSC Part Name: 1个P沟道 耐压:30V 电流:4.2A; Supplier Part: C727156; Manufacturer: TWGMC(台湾迪嘉); Supplier Footprint: SOT-23; JLCPCB Part Class: 扩展库; Datasheet: https://atta.szlcsc.com/upload/public/pdf/source/20200827/C727156_6E081BBEEFBC6B8FEE164CB196B0AF30.pdf; Supplier: LCSC; Type: 1个P沟道; Drain Source Voltage (Vdss): 30V; Continuous Drain Current (Id): 4.2A; Drain Source On Resistance (RDS(on)@Vgs,Id): 65mΩ@10V,4.2A; Power Dissipation (Pd): 350mW; Gate Threshold Voltage (Vgs(th)@Id): 1.3V@250uA; Input Capacitance (Ciss@Vds): 954pF; Reverse Transfer Capacitance (Crss@Vds): 77pF; Operating Temperature: -55℃~+150℃
R1 = 0603WAF4701T5E: 电阻类型:厚膜电阻;阻值:4.7kΩ;精度:±1%;功率:100mW;最大工作电压:75V;温度系数:±100ppm/℃;; LCSC Part Name: 4.7kΩ ±1% 100mW 厚膜电阻; Supplier Part: C23162; Manufacturer: UNI-ROYAL(厚声); Supplier Footprint: 0603; JLCPCB Part Class: Basic Part; Datasheet: https://atta.szlcsc.com/upload/public/pdf/source/20200306/C422600_1E6D84923E4A46A82E41ADD87F860B5C.pdf; Supplier: LCSC; Type: 厚膜电阻; Tolerance: ±1%; Power(Watts): 100mW; Overload Voltage (Max): 75V; Temperature Coefficient: ±100ppm/℃; Operating Temperature Range: -55℃~+155℃
R3 = 0603WAF2052T5E: 电阻类型:厚膜电阻;阻值:20.5kΩ;精度:±1%;功率:100mW;最大工作电压:75V;温度系数:±100ppm/℃;; LCSC Part Name: 20.5kΩ ±1% 100mW 厚膜电阻; Supplier Part: C22910; Manufacturer: UNI-ROYAL(厚声); Supplier Footprint: 0603; JLCPCB Part Class: 扩展库; Datasheet: https://atta.szlcsc.com/upload/public/pdf/source/20200306/C422600_1E6D84923E4A46A82E41ADD87F860B5C.pdf; Supplier: LCSC; Type: 厚膜电阻; Tolerance: ±1%; Power(Watts): 100mW; Overload Voltage (Max): 75V; Temperature Coefficient: ±100ppm/℃; Operating Temperature Range: -55℃~+155℃
R4 = 0603WAF5111T5E: 电阻类型:厚膜电阻;阻值:5.11kΩ;精度:±1%;功率:100mW;最大工作电压:75V;温度系数:±100ppm/℃;; LCSC Part Name: 5.11kΩ ±1% 100mW 厚膜电阻; Supplier Part: C23067; Manufacturer: UNI-ROYAL(厚声); Supplier Footprint: 0603; JLCPCB Part Class: Extended Part; Datasheet: https://atta.szlcsc.com/upload/public/pdf/source/20200306/C422600_1E6D84923E4A46A82E41ADD87F860B5C.pdf; Supplier: LCSC; Type: 厚膜电阻; Tolerance: ±1%; Power(Watts): 100mW; Overload Voltage (Max): 75V; Temperature Coefficient: ±100ppm/℃; Operating Temperature Range: -55℃~+155℃
R5 = 0603WAF1332T5E: 电阻类型:厚膜电阻;阻值:13.3kΩ;精度:±1%;功率:100mW;最大工作电压:75V;温度系数:±100ppm/℃;; LCSC Part Name: 13.3kΩ ±1% 100mW 厚膜电阻; Supplier Part: C25952; Manufacturer: UNI-ROYAL(厚声); Supplier Footprint: 0603; JLCPCB Part Class: 扩展库; Datasheet: https://atta.szlcsc.com/upload/public/pdf/source/20200306/C422600_1E6D84923E4A46A82E41ADD87F860B5C.pdf; Supplier: LCSC; Type: 厚膜电阻; Tolerance: ±1%; Power(Watts): 100mW; Overload Voltage (Max): 75V; Temperature Coefficient: ±100ppm/℃; Operating Temperature Range: -55℃~+155℃
SW1 = MSK12C02: 电路结构:单刀双掷;安装方式:卧贴;开关颜色:-;额定电流(DC):50mA;额定电压(DC):12V;额定电流(AC):-;额定电压(AC):-;机械寿命:1万次;; LCSC Part Name: 两档侧拨贴片 7脚 滑动开关; Supplier Part: C431540; Manufacturer: SHOU HAN(首韩); Supplier Footprint: SMD; JLCPCB Part Class: 扩展库; Datasheet: https://atta.szlcsc.com/upload/public/pdf/source/20190925/C431540_89155AEF0758B9AD1B2D805F83FB12E3.pdf; Supplier: LCSC; Circuit: 单刀双掷; Pin Style: SMD接片; Switch Length: 8mm; Switch Width: 2.8mm; Switch Height: 1.4mm; Mounting Style: 卧贴; Current Rating (DC): 50mA; Voltage Rating (DC): 12V; Mechanical Life: 1万次; Operating Temperature: -20℃~+70℃
U1 = TPS63900DSKR: 输入电压:1.8V~5.5V;输出电流:400mA;; LCSC Part Name: 1.8V至5.5V,75nA超低静态电流同步升降压转换器; Supplier Part: C1518762; Manufacturer: TI(德州仪器); Supplier Footprint: WSON-10-EP(2.5x2.5); JLCPCB Part Class: 扩展库; Datasheet: https://www.ti.com/cn/lit/gpn/tps63900; Supplier: LCSC; Input Voltage: 1.8V~5.5V; Output Current: 400mA; Operating Temperature: -40℃~+125℃@(TJ); Synchronous Rectification: 是; Topology: 降压-升压式
U2 = SMD0805-010: 最大电压:15V;最大电流:100A;保持电流:100mA;跳闸电流:300mA;; LCSC Part Name: 15V 100mA 0805自恢复; Supplier Part: C70054; Manufacturer: 台湾陆海; Supplier Footprint: 0805; JLCPCB Part Class: Extended Part; Datasheet: https://atta.szlcsc.com/upload/public/pdf/source/20160331/1459396375918.pdf; Supplier: LCSC; Operating Voltage (Max): 15V; Current Rating (Max): 100A; Hold Current: 100mA; Trip Current: 300mA

## Nets
3V: C2.2 Q1.2(S) U1.6(VOUT)
GND: C1.1 C2.1 R3.1 R4.1 R5.1 U1.8(GND) U1.11(EP)
VCC: C1.2 D1.1(C) SW1.2 U1.1(EN) U1.2(SEL) U1.10(VIN)
VCC_CAP: U2.2
LED+: Q1.3(D)
SOLAR_VCC: D1.2(A) R1.2
$1N1286: L1.1 U1.9(LX1)
$1N1290: L1.2 U1.7(LX2)
$1N1305: R3.2 U1.3(CFG1)
$1N1309: R4.2 U1.4(CFG2)
$1N1314: R5.2 U1.5(CFG3)
$1N3593: Q1.1(G) R1.1
$1N4546: SW1.3 U2.1

Not connected (* = marked no-connect by the designer): SW1 1* 4*

## Notes on the sheet
- 5.5V 0.33F
- SuperCapacitor
- SOLAR_VCC: 0 ~ 5.5V
- S = 3V
- LED Part
- G = 0 ~ 5.5V
- Gate Open Voltage (Typically): VGS(th) ≤ -0.9V
- Update:
- 1. R1阻值  1MΩ --> 4.7kΩ
  2. Q1位置更改，更改为上管
- Update (2025.1.8):
- 1. R4阻值 1.15kΩ --> 5.11kΩ
  （目的是将50mA的输入电流更改为2.5mA，降低LED亮度）
- Update (2025.3.9):
- 1. 增加开关OFF和ON的丝印

# Board \
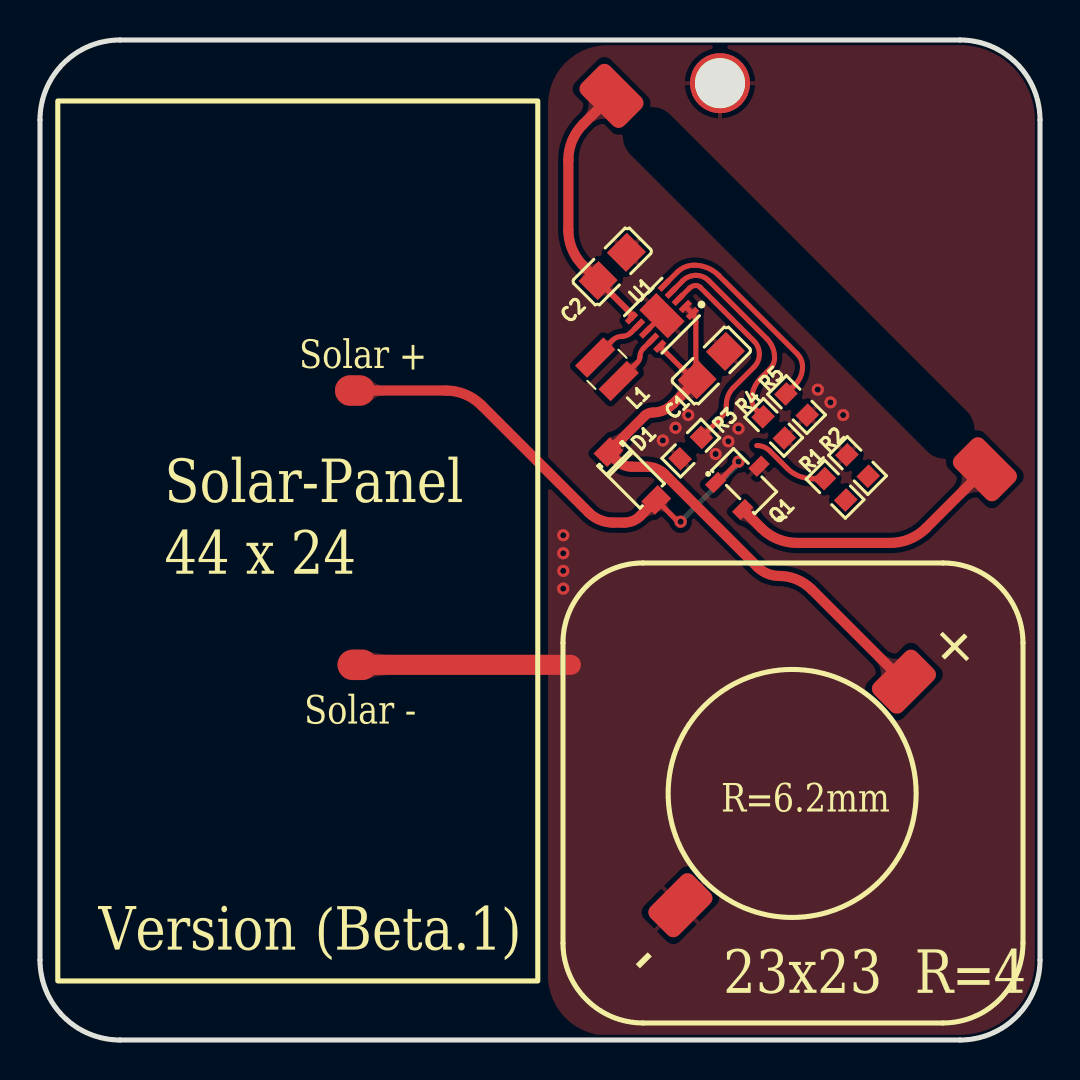
[diagram p3: board, top side]
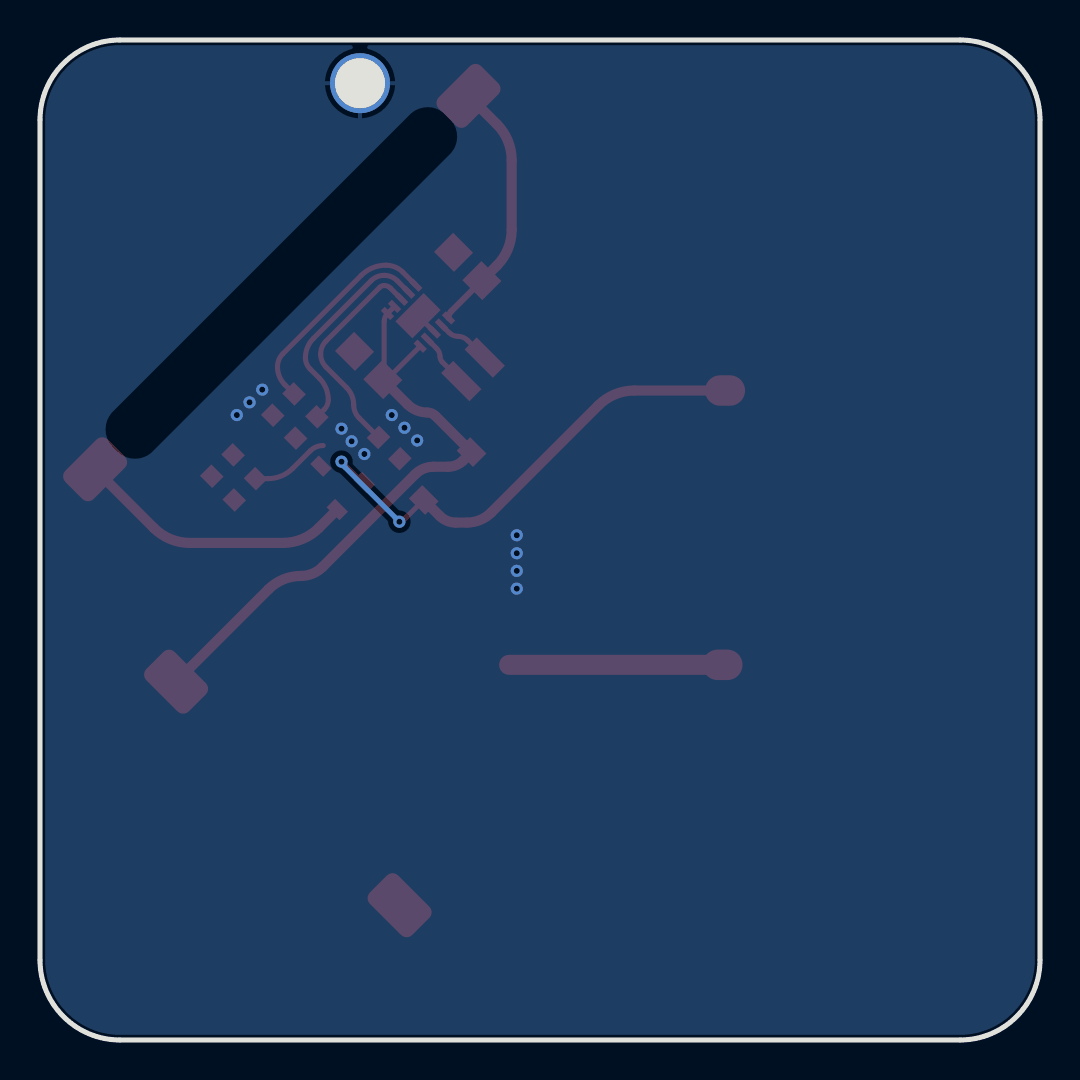
[diagram p4: board, bottom side, seen from below]

Outline 50 x 50 mm; copper layers: Top Layer, Bottom Layer. Coordinates in mm from the lower left corner of the outline.
Outline path: 0,46 0,4 arc(1.17,1.17) 4,0 46,0 arc(48.83,1.17) 50,4 50,46 arc(48.83,48.83) 46,50 4,50 arc(1.17,48.83) 0,46
Stack: Top Layer 0.035mm / Dielectric1 1.51mm FR4 er 4.5 / Bottom Layer 0.035mm

## Design rules (mm)
template: JLCPCB Capability(Two Layers Board)
spacing copperThickness1oz (default): track to track 0.102, other pairs 0.152 to 0.3
spacing copperThickness2oz: track to track 0.203, other pairs 0.152 to 0.3
track width copperThickness1oz (default): min 0.127, default 0.254, max 2.54
track width copperThickness2oz: min 0.203, default 0.254, max 2.54
differential pair differentialPair (default): width min 0.127, default 0.254, max 2.54; gap min 0.152, default 0.152
via viaSize (default): diameter min 0.5, default 0.61, max 10; hole min 0.3, default 0.305, max 6.3

## Placement (name value [footprint] x y rotation side)
C1  10uF  [C0805]  33.57 33.72 225 top
C2  22uF  [C0805]  28.61 38.68 225 top
D1  1N5819W  [SOD-123_L2.8-W1.8-LS3.7-RD]  29.62 28.2 315 top
L1  2.2uH  [IND-SMD_L2.5-W2.0-VLS252012CX-150M]  28.35 33.53 135 top
NOREF  -  [Pad_e32]  32.02 6.74 135 top
NOREF#2  -  [Pad_e21]  15.88 18.76 0 top
NOREF#3  -  [Pad_e28]  28.57 47.21 45 top
NOREF#4  -  [Pad_e30]  47.24 28.54 45 top
NOREF#5  -  [Pad_e492]  34 47.84 0 top
NOREF#6  -  [Pad_e17]  15.75 32.47 0 top
NOREF#7  -  [Pad_e31]  43.2 17.92 135 top
Q1  AO3401  [SOT-23-3_L2.9-W1.4-P1.90-LS2.6-BR]  35.21 27.95 225 top
R1  1MΩ  [R0603]  39.75 27.53 135 top
R2  330kΩ  [R0603]  40.88 28.72 315 top
R3  20.5kΩ  [R0603]  32.54 29.6 45 top
R4  1.15kΩ  [R0603]  36.69 30.63 135 top
R5  13.3kΩ  [R0603]  37.83 31.77 135 top
U1  TPS63900DSKR  [WSON-10_L2.5-W2.5-W0.50-TL-EP]  31.1 36.22 225 top

## Footprints (pads in the part's own frame, mm; a bottom-side part is the same pattern mirrored in y, then rotated)
C0805
  rect 1.41x1.35 smd: 1(-1,0) 2(1,0)
IND-SMD_L2.5-W2.0-VLS252012CX-150M
  rect 0.85x2 smd: 1(-0.83,0) 2(0.83,0)
Pad_e17
  oval 2x1.524 smd: 1(0,0)
Pad_e21
  oval 2x1.524 smd: 1(0,0)
Pad_e28
  rrect 2x3 smd: 1(0,0)
Pad_e30
  rrect 2x3 smd: 1(0,0)
Pad_e31
  rrect 2x3 smd: 1(0,0)
Pad_e32
  rrect 2x3 smd: 1(0,0)
Pad_e492
  round 3 hole 2.5: 1(0,0)
R0603
  rect 0.806x0.864 smd: 1(-0.753,0) 2(0.753,0)
SOD-123_L2.8-W1.8-LS3.7-RD
  rect 0.95x1.15 smd: 1(-1.692,0) 2(1.692,0)
SOT-23-3_L2.9-W1.4-P1.90-LS2.6-BR
  rect 0.91x0.6 smd: 1(1.055,-0.955) 2(1.055,0.955) 3(-1.055,0)
WSON-10_L2.5-W2.5-W0.50-TL-EP
  rect 0.665x0.28 smd: 1(-1.157,1) 2(-1.157,0.5) 3(-1.157,0) 4(-1.157,-0.5) 5(-1.157,-1) 6(1.157,-1) 7(1.157,-0.5) 8(1.157,0) 9(1.157,0.5) 10(1.157,1)
  rect 1.2x2 smd: 11(0,0)

## Nets
3V: C2.2 NOREF#3.1 U1.6
GND: C1.1 C2.1 NOREF.1 NOREF#2.1 NOREF#5.1 Q1.3 R2.1 R3.1 R4.1 R5.1 U1.8 U1.11
CAP_VCC: C1.2 D1.1 NOREF#7.1 U1.1 U1.2 U1.10
LED-: NOREF#4.1 Q1.2
SOLAR_VCC: D1.2 NOREF#6.1 Q1.1
$1N1286: L1.1 U1.9
$1N1290: L1.2 U1.7
$1N1305: R3.2 U1.3
$1N1309: R4.2 U1.4
$1N1314: R5.2 U1.5

Pads without a net: R1 1 2; R2 2

## Via types
v1: diameter 0.61, hole 0.305, Top Layer to Bottom Layer, 15 vias

## Routing (per net, layer and track width the routed paths; a pad name or vN(x,y) marks a point on that pad's centre or on a via; arc(x,y) is an arc through that point)
3V: length 13.1
  Top Layer w0.305: C2.2 29.43,36.44 arc(29.54,36.29) U1.6
  Top Layer w0.508: NOREF#3.1 27.16,45.79 arc(26.61,44.97) 26.42,44 26.42,40.51 arc(26.61,39.54) 27.16,38.72 C2.2
GND: length 11.8
  Top Layer w0.254: 30.28,35.4 U1.11
  Top Layer w1.001: NOREF#2.1 26.54,18.76
  vias: v1(26.16,25.24) v1(26.16,24.34) v1(26.16,23.46) v1(26.16,22.57) v1(31.14,29.98) v1(31.78,30.61) v1(32.41,31.25) v1(33.78,29.3) v1(34.42,29.93) v1(34.93,30.57) v1(38.89,32.52) v1(39.52,31.88) v1(40.16,31.25)
(no net): length 4
  Top Layer w0.254: 39.22,28.07 38.6,28.07 arc(37.93,28.2) 37.36,28.58 36.49,29.45 arc(36.19,29.65) 35.84,29.72
CAP_VCC: length 31.5
  Top Layer w0.254: U1.2 U1.1 arc(32.75,36.14) 32.79,35.92 32.79,33.18 arc(32.81,33.09) C1.2 arc(32.68,33.05) 32.52,33.16 U1.10
  Top Layer w0.5: C1.2 31.63,31.79 arc(31.17,31.48) 30.63,31.37 arc(30.42,31.33) 30.23,31.21 D1.1
  Top Layer w0.508: NOREF#7.1 38.58,22.53 arc(37.84,23.03) 36.96,23.2 arc(36.37,23.32) 35.87,23.65 31.24,28.28 arc(30.82,28.56) 30.32,28.66 29.59,28.66 arc(29.19,28.74) 28.84,28.97 D1.1
LED-: length 14.1
  Top Layer w0.508: NOREF#4.1 44.31,25.6 arc(43.48,25.05) 42.51,24.85 37.86,24.85 arc(36.89,25.05) 36.06,25.6 Q1.2
SOLAR_VCC: length 25.4
  Top Layer w0.254: v1(34.93,28.92) 33.95,27.94 arc(33.87,27.89) 33.78,27.88 ; 30.81,27 31.81,26 arc(31.91,25.94) v1(32.03,25.91)
  Top Layer w0.508: NOREF#6.1 20.28,32.47 arc(21.26,32.28) 22.08,31.73 27.43,26.38 arc(27.99,26) 28.66,25.87 29.21,25.87 arc(29.65,25.96) 30.01,26.2 30.81,27
  Bottom Layer w0.254: v1(32.03,25.91) 34.85,28.73 arc(34.9,28.82) v1(34.93,28.92)
$1N1286: length 2.8
  Top Layer w0.254: U1.9 30.17,34.58 arc(30.04,34.39) 30,34.17 arc(29.97,34.02) 29.89,33.9 28.93,32.95
$1N1290: length 2.8
  Top Layer w0.254: L1.2 28.62,34.98 arc(28.85,35.13) 29.11,35.18 arc(29.34,35.23) 29.54,35.36 U1.7
$1N1305: length 11.1
  Top Layer w0.254: U1.3 32.48,37.59 arc(32.62,37.69) 32.79,37.72 arc(32.91,37.7) 33.01,37.64 35.7,34.95 arc(35.9,34.65) 35.97,34.3 arc(35.9,33.94) 35.7,33.64 34.68,32.62 arc(34.41,32.22) 34.32,31.76 arc(34.25,31.4) 34.05,31.11 R3.2
$1N1309: length 10.9
  Top Layer w0.254: U1.4 32.14,37.96 arc(32.44,38.16) 32.79,38.23 arc(33.14,38.16) 33.44,37.96 36.33,35.07 arc(36.63,34.63) 36.73,34.12 arc(36.67,33.81) 36.5,33.56 36.04,33.09 arc(35.7,32.6) 35.59,32.01 arc(35.64,31.75) 35.79,31.53 R4.2
$1N1314: length 11.1
  Top Layer w0.254: 31.21,37.74 31.86,38.39 arc(32.25,38.65) 32.71,38.74 arc(33.37,38.61) 33.94,38.23 37.86,34.31 arc(38.06,34.01) 38.13,33.66 arc(38.03,33.17) 37.75,32.76 37.3,32.3

## Copper pours and planes (outline as drawn; the poured copper is in the pictures)
GND on Top Layer: 25.4,46.75 25.41,47.01 25.46,47.35 25.55,47.69 25.68,48.01 25.85,48.32 26.05,48.61 26.28,48.87 26.54,49.1 26.83,49.3 27.13,49.46 27.46,49.59 27.79,49.68 28.14,49.73 28.4,49.75 46.78,49.75 47.05,49.73 47.39,49.68 47.73,49.59 48.05,49.46 48.36,49.3 48.64,49.1 48.91,48.87 49.14,48.61 49.34,48.32 49.5,48.01 49.63,47.69 49.72,47.35 49.77,47.01 49.78,46.75 49.78,3.22 49.77,2.95 49.72,2.61 49.63,2.27 49.5,1.95 49.34,1.64 49.14,1.36 48.91,1.09 48.64,0.86 48.36,0.66 48.05,0.5 47.73,0.37 47.39,0.28 47.05,0.23 46.78,0.22 28.4,0.22 28.14,0.23 27.79,0.28 27.46,0.37 27.13,0.5 26.83,0.66 26.54,0.86 26.28,1.09 26.05,1.36 25.85,1.64 25.68,1.95 25.55,2.27 25.46,2.61 25.41,2.95 25.4,3.22
GND on Bottom Layer: -1.4,51.4 52.83,51.4 52.83,-1.56 -1.4,-1.56

Small or netless copper shapes (teardrops, artwork), in the pictures only: 32 on Top Layer, 2 on Bottom Layer

## Text on the board
Top Silkscreen Layer: Solar + | Solar - | R=6.2mm | Version (Beta.1) | Solar-Panel / 44 x 24 | 23x23  R=4 | + | -

# Board \_2
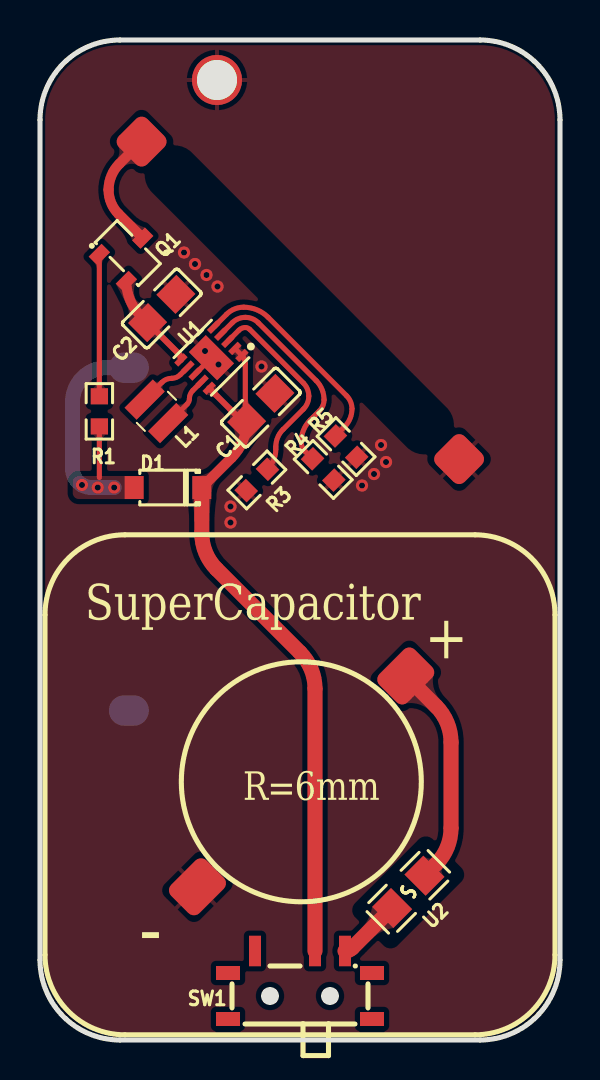
[diagram p5: board, top side]
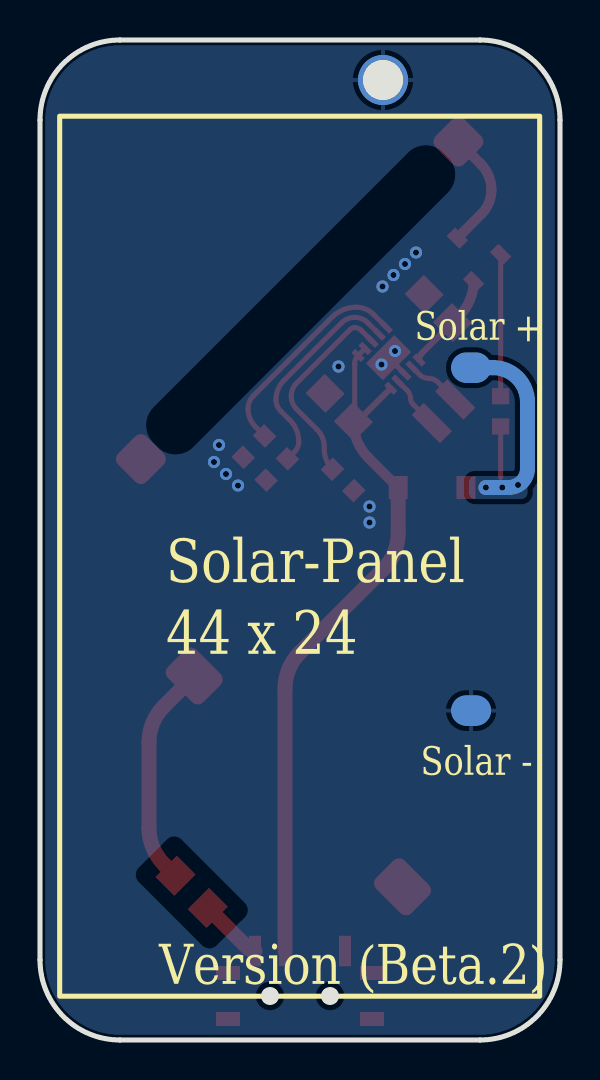
[diagram p6: board, bottom side, seen from below]

Outline 26 x 50 mm; copper layers: Top Layer, Bottom Layer. Coordinates in mm from the lower left corner of the outline.
Outline path: 0,46 0,4 arc(1.17,1.17) 4,0 22,0 arc(24.83,1.17) 26,4 26,46 arc(24.83,48.83) 22,50 4,50 arc(1.17,48.83) 0,46
Stack: Top Layer 0.035mm / Dielectric1 1.51mm FR4 er 4.5 / Bottom Layer 0.035mm

## Design rules (mm)
template: JLCPCB Capability(Two Layers Board)
spacing copperThickness1oz (default): track to track 0.102, other pairs 0.152 to 0.3
spacing copperThickness2oz: track to track 0.203, other pairs 0.152 to 0.3
track width copperThickness1oz (default): min 0.127, default 0.254, max 2.54
track width copperThickness2oz: min 0.203, default 0.254, max 2.54
differential pair differentialPair (default): width min 0.127, default 0.254, max 2.54; gap min 0.152, default 0.152
via viaSize (default): diameter min 0.5, default 0.61, max 10; hole min 0.3, default 0.305, max 6.3

## Placement (name value [footprint] x y rotation side)
C1  10uF  [C0805]  11.04 31.62 225 top
C2  22uF  [C0805]  6.09 36.58 225 top
D1  1N5819W  [SOD-123_L2.8-W1.8-LS3.7-RD]  6.4 27.62 180 top
L1  2.2uH  [IND-SMD_L2.5-W2.0-VLS252012CX-150M]  5.82 31.43 135 top
NOREF  -  [Pad_e31]  18.29 18.2 135 top
NOREF#2  -  [Pad_e28]  5.08 44.92 45 top
NOREF#3  -  [Pad_e30]  20.96 29.05 45 top
NOREF#4  -  [Pad_e21]  4.44 16.47 0 top
NOREF#5  -  [Pad_e492]  8.85 48 0 top
NOREF#6  -  [Pad_e32]  7.87 7.66 135 top
NOREF#7  -  [Pad_e17]  4.44 33.62 0 top
Q1  AO3401  [SOT-23-3_L2.9-W1.4-P1.90-LS2.6-BR]  4.39 39.35 225 top
R1  4.7kΩ  [R0603]  2.97 31.43 270 top
R3  20.5kΩ  [R0603]  10.84 28 45 top
R4  1.15kΩ  [R0603]  14.16 28.53 135 top
R5  13.3kΩ  [R0603]  15.3 29.67 135 top
SW1  MSK12C02  [SW-TH_MSK12C02]  13 2.75 0 top
U1  TPS63900DSKR  [WSON-10_L2.5-W2.5-W0.50-TL-EP]  8.57 34.11 225 top
U2  SMD0805-010  [F0805]  18.41 7.41 45 top

## Footprints (pads in the part's own frame, mm; a bottom-side part is the same pattern mirrored in y, then rotated)
C0805
  rect 1.41x1.35 smd: 1(-1,0) 2(1,0)
F0805
  rect 1.335x1.5 smd: 1(-1.142,0) 2(1.142,0)
IND-SMD_L2.5-W2.0-VLS252012CX-150M
  rect 0.85x2 smd: 1(-0.83,0) 2(0.83,0)
Pad_e17
  oval 2x1.524 smd far side: 1(0,0)
Pad_e21
  oval 2x1.524 smd far side: 1(0,0)
Pad_e28
  rrect 2x2 smd: 1(0,0)
Pad_e30
  rrect 2x2 smd: 1(0,0)
Pad_e31
  rrect 2x2.5 smd: 1(0,0)
Pad_e32
  rrect 2x2.5 smd: 1(0,0)
Pad_e492
  round 2.5 hole 2: 1(0,0)
R0603
  rect 0.806x0.864 smd: 1(-0.753,0) 2(0.753,0)
SOD-123_L2.8-W1.8-LS3.7-RD
  rect 0.95x1.15 smd: 1(-1.692,0) 2(1.692,0)
SOT-23-3_L2.9-W1.4-P1.90-LS2.6-BR
  rect 0.91x0.6 smd: 1(1.055,-0.955) 2(1.055,0.955) 3(-1.055,0)
SW-TH_MSK12C02
  rect 0.6x1.524 smd: 1(-2.25,1.7) 2(0.75,1.7) 3(2.25,1.7)
  rect 1.2x0.7 smd: 4(-3.6,0.6) 4(-3.6,-1.7) 4(3.6,0.6) 4(3.6,-1.7)
WSON-10_L2.5-W2.5-W0.50-TL-EP
  rect 0.665x0.28 smd: 1(-1.157,1) 2(-1.157,0.5) 3(-1.157,0) 4(-1.157,-0.5) 5(-1.157,-1) 6(1.157,-1) 7(1.157,-0.5) 8(1.157,0) 9(1.157,0.5) 10(1.157,1)
  rect 1.2x2 smd: 11(0,0)

## Nets
3V: C2.2 Q1.2 U1.6
GND: C1.1 C2.1 NOREF#3.1 NOREF#4.1 NOREF#5.1 NOREF#6.1 R3.1 R4.1 R5.1 U1.8 U1.11
VCC: C1.2 D1.1 SW1.2 U1.1 U1.2 U1.10
VCC_CAP: NOREF.1 U2.2
LED+: NOREF#2.1 Q1.3
SOLAR_VCC: D1.2 NOREF#7.1 R1.2
$1N1286: L1.1 U1.9
$1N1290: L1.2 U1.7
$1N1305: R3.2 U1.3
$1N1309: R4.2 U1.4
$1N1314: R5.2 U1.5
$1N3593: Q1.1 R1.1
$1N4546: SW1.3 U2.1

Pads without a net: SW1 1 4

## Via types
v1: diameter 0.61, hole 0.305, Top Layer to Bottom Layer, 16 vias

## Routing (per net, layer and track width the routed paths; a pad name or vN(x,y) marks a point on that pad's centre or on a via; arc(x,y) is an arc through that point)
3V: length 4.9
  Top Layer w0.305: 5.38,35.87 6.91,34.34 arc(7.01,34.19) U1.6
  Top Layer w0.508: 5.38,35.87 5.02,36.23 arc(4.5,37.01) Q1.2
GND: length 1.2
  Top Layer w0.254: 7.75,33.3 8.57,34.11
  vias: v1(7.2,39.37) v1(7.75,38.8) v1(8.33,38.25) v1(8.25,34.45) v1(8.88,37.67) v1(8.93,33.77) v1(9.53,26.67) v1(9.53,25.87) v1(11.08,33.67) v1(16.1,27.72) v1(16.7,28.3) v1(17.05,29.75) v1(17.3,28.9)
VCC: length 35.8
  Top Layer w0.254: U1.2 10.1,34.23 arc(10.22,34.04) 10.26,33.82 10.26,31.08 arc(10.28,30.99) C1.2
  Top Layer w0.3: 8.46,32.59 9.99,31.06 arc(10.15,30.95) C1.2
  Top Layer w0.508: D1.1 9.59,29.12 arc(10.14,29.94) C1.2
  Top Layer w0.75: SW1.2 13.75,17.57 arc(13.56,18.54) 13.01,19.37 8.83,23.54 arc(8.28,24.36) 8.09,25.34 D1.1
VCC_CAP: length 11.3
  Top Layer w0.75: 19.22,8.22 19.81,8.8 arc(20.36,9.62) 20.55,10.59 20.55,14.89 arc(20.36,15.86) 19.81,16.68 NOREF.1
LED+: length 6.1
  Top Layer w0.508: Q1.3 3.93,41.3 arc(3.56,41.85) 3.43,42.51 arc(3.57,43.21) 3.97,43.81 NOREF#2.1
SOLAR_VCC: length 12.3
  Top Layer w0.254: R1.2 2.97,28.12
  Bottom Layer w0.75: v1(3.71,27.62) v1(2.89,27.62) 2.57,27.62 arc(2.33,27.66) v1(2.1,27.75) arc(1.75,28.1) 1.62,28.57 1.62,31.9 arc(2.13,33.11) 3.34,33.62 NOREF#7.1
$1N1286: length 2.8
  Top Layer w0.254: 6.41,30.85 7.36,31.8 arc(7.44,31.92) 7.47,32.07 arc(7.51,32.29) 7.64,32.48 U1.9
$1N1290: length 2.8
  Top Layer w0.254: U1.7 7.01,33.26 arc(6.81,33.13) 6.58,33.08 arc(6.32,33.03) 6.1,32.88 5.23,32.02
$1N1305: length 10.3
  Top Layer w0.254: U1.3 9.95,35.49 arc(10.09,35.59) 10.26,35.62 arc(10.38,35.6) 10.48,35.53 13.17,32.85 arc(13.37,32.55) 13.44,32.19 arc(13.37,31.84) 13.17,31.54 12.15,30.52 arc(11.88,30.12) 11.79,29.66 11.79,29.54 arc(11.68,28.99) R3.2
$1N1309: length 10.9
  Top Layer w0.254: U1.4 9.61,35.86 arc(9.91,36.06) 10.26,36.13 arc(10.62,36.06) 10.92,35.86 13.81,32.97 arc(14.1,32.53) 14.2,32.02 arc(14.14,31.71) 13.97,31.45 13.51,30.99 arc(13.18,30.5) 13.06,29.91 arc(13.11,29.65) 13.26,29.43 R4.2
$1N1314: length 11.1
  Top Layer w0.254: R5.2 15.23,30.66 arc(15.5,31.07) 15.6,31.56 arc(15.53,31.91) 15.33,32.21 11.41,36.13 arc(10.85,36.51) 10.18,36.64 arc(9.72,36.55) 9.33,36.29 8.68,35.64
$1N3593: length 7.1
  Top Layer w0.254: Q1.1 2.97,32.19
$1N4546: length 3.2
  Top Layer w0.75: U2.1 15.6,4.6 arc(15.44,4.49) SW1.3

## Copper pours and planes (outline as drawn; the poured copper is in the pictures)
GND on Top Layer: -5.27,49.17 -5.26,49.43 -5.21,49.78 -5.12,50.11 -4.99,50.44 -4.82,50.75 -4.62,51.03 -4.39,51.29 -4.13,51.52 -3.84,51.72 -3.54,51.89 -3.21,52.02 -2.88,52.11 -2.53,52.16 -2.27,52.17 26.66,52.17 26.92,52.16 27.26,52.11 27.6,52.02 27.92,51.89 28.23,51.72 28.52,51.52 28.78,51.29 29.01,51.03 29.21,50.75 29.37,50.44 29.5,50.11 29.59,49.78 29.64,49.43 29.66,49.17 29.66,-1.72 29.64,-1.99 29.59,-2.33 29.5,-2.67 29.37,-2.99 29.21,-3.3 29.01,-3.59 28.78,-3.85 28.52,-4.08 28.23,-4.28 27.92,-4.44 27.6,-4.57 27.26,-4.66 26.92,-4.71 26.66,-4.72 -2.27,-4.72 -2.53,-4.71 -2.88,-4.66 -3.21,-4.57 -3.54,-4.44 -3.84,-4.28 -4.13,-4.08 -4.39,-3.85 -4.62,-3.59 -4.82,-3.3 -4.99,-2.99 -5.12,-2.67 -5.21,-2.33 -5.26,-1.99 -5.27,-1.72
GND on Bottom Layer: -7.51,51.29 33.38,51.29 33.38,-1.93 -7.51,-1.93
SOLAR_VCC on Top Layer: 1.64,28.2 5.16,28.2 5.16,27.05 1.64,27.05
SOLAR_VCC on Bottom Layer: 1.62,28.2 4.55,28.2 4.55,27.05 1.62,27.05

Small or netless copper shapes (teardrops, artwork), in the pictures only: 29 on Top Layer, 1 on Bottom Layer

## Text on the board
Bottom Solder Mask Layer: Lights turn your         road.
Bottom Silkscreen Layer: Solar - | Solar + | Version (Beta.2) | Solar-Panel / 44 x 24
Top Solder Mask Layer: Please / don't take / my sunshine / away : )
Top Silkscreen Layer: R=6mm | SuperCapacitor | + | -

# Board \_3
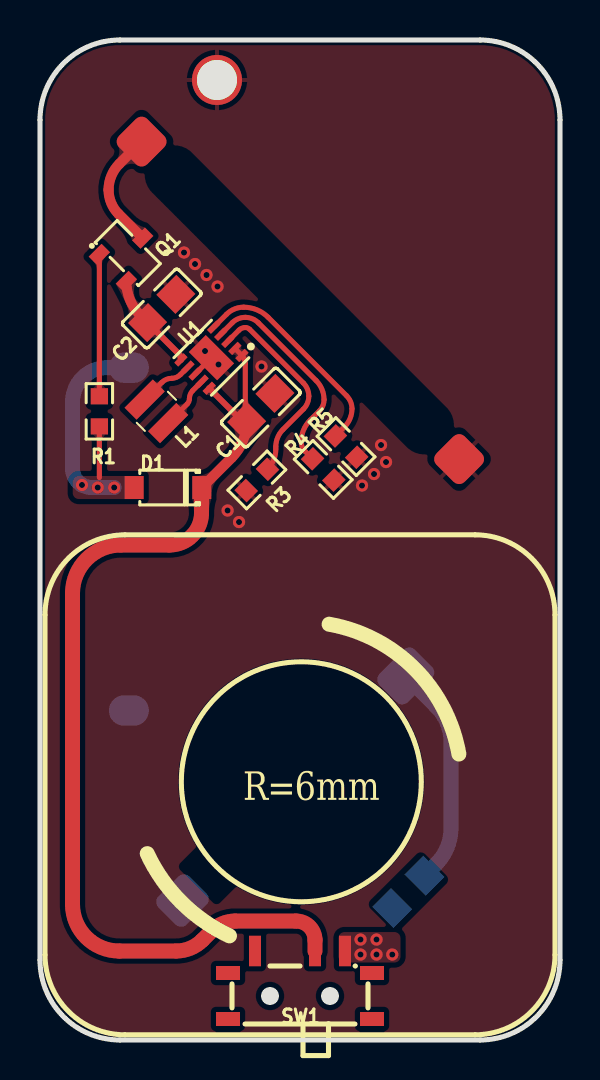
[diagram p7: board, top side]
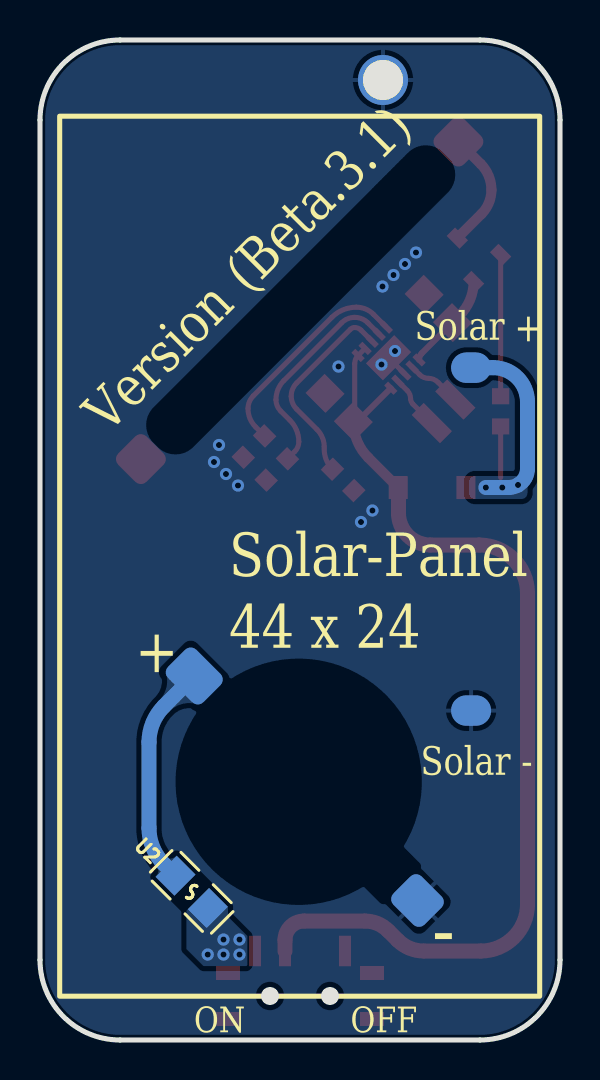
[diagram p8: board, bottom side, seen from below]

Outline 26 x 50 mm; copper layers: Top Layer, Bottom Layer. Coordinates in mm from the lower left corner of the outline.
Outline path: 0,46 0,4 arc(1.17,1.17) 4,0 22,0 arc(24.83,1.17) 26,4 26,46 arc(24.83,48.83) 22,50 4,50 arc(1.17,48.83) 0,46
Stack: Top Layer 0.035mm / Dielectric1 1.51mm FR4 er 4.5 / Bottom Layer 0.035mm

## Design rules (mm)
template: JLCPCB Capability(Two Layers Board)
spacing copperThickness1oz (default): track to track 0.102, other pairs 0.152 to 0.3
spacing copperThickness2oz: track to track 0.203, other pairs 0.152 to 0.3
track width copperThickness1oz (default): min 0.127, default 0.254, max 2.54
track width copperThickness2oz: min 0.203, default 0.254, max 2.54
differential pair differentialPair (default): width min 0.127, default 0.254, max 2.54; gap min 0.152, default 0.152
via viaSize (default): diameter min 0.5, default 0.61, max 10; hole min 0.3, default 0.305, max 6.3

## Placement (name value [footprint] x y rotation side)
C1  10uF  [C0805]  11.04 31.62 225 top
C2  22uF  [C0805]  6.09 36.58 225 top
D1  1N5819W  [SOD-123_L2.8-W1.8-LS3.7-RD]  6.4 27.62 180 top
L1  2.2uH  [IND-SMD_L2.5-W2.0-VLS252012CX-150M]  5.82 31.43 135 top
NOREF  -  [Pad_e31]  18.29 18.2 135 top
NOREF#2  -  [Pad_e28]  5.08 44.92 45 top
NOREF#3  -  [Pad_e17]  4.44 33.62 0 top
NOREF#4  -  [Pad_e32]  7.13 6.97 135 top
NOREF#5  -  [Pad_e492]  8.85 48 0 top
NOREF#6  -  [Pad_e30]  20.96 29.05 45 top
NOREF#7  -  [Pad_e21]  4.44 16.47 0 top
Q1  AO3401  [SOT-23-3_L2.9-W1.4-P1.90-LS2.6-BR]  4.39 39.35 225 top
R1  4.7kΩ  [R0603]  2.97 31.43 270 top
R3  20.5kΩ  [R0603]  10.84 28 45 top
R4  5.11kΩ  [R0603]  14.16 28.53 135 top
R5  13.3kΩ  [R0603]  15.3 29.67 135 top
SW1  MSK12C02  [SW-TH_MSK12C02]  13 2.75 0 top
U1  TPS63900DSKR  [WSON-10_L2.5-W2.5-W0.50-TL-EP]  8.57 34.11 225 top
U2  SMD0805-010  [F0805]  18.41 7.41 45 bottom

## Footprints (pads in the part's own frame, mm; a bottom-side part is the same pattern mirrored in y, then rotated)
C0805
  rect 1.41x1.35 smd: 1(-1,0) 2(1,0)
F0805
  rect 1.335x1.5 smd: 1(-1.142,0) 2(1.142,0)
IND-SMD_L2.5-W2.0-VLS252012CX-150M
  rect 0.85x2 smd: 1(-0.83,0) 2(0.83,0)
Pad_e17
  oval 2x1.524 smd far side: 1(0,0)
Pad_e21
  oval 2x1.524 smd far side: 1(0,0)
Pad_e28
  rrect 2x2 smd: 1(0,0)
Pad_e30
  rrect 2x2 smd: 1(0,0)
Pad_e31
  rrect 2x2.5 smd far side: 1(0,0)
Pad_e32
  rrect 2x2.2 smd far side: 1(0,0)
Pad_e492
  round 2.5 hole 2: 1(0,0)
R0603
  rect 0.806x0.864 smd: 1(-0.753,0) 2(0.753,0)
SOD-123_L2.8-W1.8-LS3.7-RD
  rect 0.95x1.15 smd: 1(-1.692,0) 2(1.692,0)
SOT-23-3_L2.9-W1.4-P1.90-LS2.6-BR
  rect 0.91x0.6 smd: 1(1.055,-0.955) 2(1.055,0.955) 3(-1.055,0)
SW-TH_MSK12C02
  rect 0.6x1.524 smd: 1(-2.25,1.7) 2(0.75,1.7) 3(2.25,1.7)
  rect 1.2x0.7 smd: 4(-3.6,0.6) 4(-3.6,-1.7) 4(3.6,0.6) 4(3.6,-1.7)
WSON-10_L2.5-W2.5-W0.50-TL-EP
  rect 0.665x0.28 smd: 1(-1.157,1) 2(-1.157,0.5) 3(-1.157,0) 4(-1.157,-0.5) 5(-1.157,-1) 6(1.157,-1) 7(1.157,-0.5) 8(1.157,0) 9(1.157,0.5) 10(1.157,1)
  rect 1.2x2 smd: 11(0,0)

## Nets
3V: C2.2 Q1.2 U1.6
GND: C1.1 C2.1 NOREF#4.1 NOREF#5.1 NOREF#6.1 NOREF#7.1 R3.1 R4.1 R5.1 U1.8 U1.11
VCC: C1.2 D1.1 SW1.2 U1.1 U1.2 U1.10
VCC_CAP: NOREF.1 U2.2
LED+: NOREF#2.1 Q1.3
SOLAR_VCC: D1.2 NOREF#3.1 R1.2
$1N1286: L1.1 U1.9
$1N1290: L1.2 U1.7
$1N1305: R3.2 U1.3
$1N1309: R4.2 U1.4
$1N1314: R5.2 U1.5
$1N3593: Q1.1 R1.1
$1N4546: SW1.3 U2.1

Pads without a net: SW1 1 4

## Via types
v1: diameter 0.61, hole 0.305, Top Layer to Bottom Layer, 21 vias

## Routing (per net, layer and track width the routed paths; a pad name or vN(x,y) marks a point on that pad's centre or on a via; arc(x,y) is an arc through that point)
3V: length 4.9
  Top Layer w0.305: 5.38,35.87 6.91,34.34 arc(7.01,34.19) U1.6
  Top Layer w0.508: 5.38,35.87 5.02,36.23 arc(4.5,37.01) Q1.2
GND: length 1.2
  Top Layer w0.254: 7.75,33.3 8.57,34.11
  vias: v1(7.2,39.37) v1(7.75,38.8) v1(8.33,38.25) v1(8.25,34.45) v1(8.88,37.67) v1(8.93,33.77) v1(9.38,26.47) v1(9.95,25.9) v1(11.08,33.67) v1(16.1,27.72) v1(16.7,28.3) v1(17.05,29.75) v1(17.3,28.9)
VCC: length 51.1
  Top Layer w0.254: U1.2 10.1,34.23 arc(10.22,34.04) 10.26,33.82 10.26,31.08 arc(10.28,30.99) C1.2
  Top Layer w0.3: 8.46,32.59 9.99,31.06 arc(10.15,30.95) C1.2
  Top Layer w0.508: D1.1 9.59,29.12 arc(10.14,29.94) C1.2
  Top Layer w0.75: SW1.2 13.75,5 arc(13.47,5.67) 12.8,5.95 9.75,5.95 arc(9.13,5.82) 8.59,5.47 8.12,4.99 arc(7.52,4.59) 6.81,4.45 3.97,4.45 arc(2.31,5.13) 1.62,6.79 1.62,22.33 arc(2.33,24.04) 4.04,24.75 6.48,24.75 arc(7.61,25.22) 8.08,26.35 8.08,27.61 arc(8.08,27.62) D1.1
VCC_CAP: length 11.3
  Bottom Layer w0.75: NOREF.1 19.81,16.68 arc(20.36,15.86) 20.55,14.89 20.55,10.59 arc(20.36,9.62) 19.81,8.8 19.22,8.22
LED+: length 6.1
  Top Layer w0.508: Q1.3 3.93,41.3 arc(3.56,41.85) 3.43,42.51 arc(3.57,43.21) 3.97,43.81 NOREF#2.1
SOLAR_VCC: length 12.3
  Top Layer w0.254: R1.2 2.97,28.12
  Bottom Layer w0.75: v1(3.71,27.62) v1(2.89,27.62) 2.57,27.62 arc(2.33,27.66) v1(2.1,27.75) arc(1.75,28.1) 1.62,28.57 1.62,31.9 arc(2.13,33.11) 3.34,33.62 NOREF#3.1
$1N1286: length 2.8
  Top Layer w0.254: U1.9 7.64,32.48 arc(7.51,32.29) 7.47,32.07 arc(7.44,31.92) 7.36,31.8 6.41,30.85
$1N1290: length 2.8
  Top Layer w0.254: 5.23,32.02 6.1,32.88 arc(6.32,33.03) 6.58,33.08 arc(6.81,33.13) 7.01,33.26 U1.7
$1N1305: length 10.3
  Top Layer w0.254: U1.3 9.95,35.49 arc(10.09,35.59) 10.26,35.62 arc(10.38,35.6) 10.48,35.53 13.17,32.85 arc(13.37,32.55) 13.44,32.19 arc(13.37,31.84) 13.17,31.54 12.15,30.52 arc(11.88,30.12) 11.79,29.66 11.79,29.54 arc(11.68,28.99) R3.2
$1N1309: length 10.9
  Top Layer w0.254: R4.2 13.26,29.43 arc(13.11,29.65) 13.06,29.91 arc(13.18,30.5) 13.51,30.99 13.97,31.45 arc(14.14,31.71) 14.2,32.02 arc(14.1,32.53) 13.81,32.97 10.92,35.86 arc(10.62,36.06) 10.26,36.13 arc(9.91,36.06) 9.61,35.86 U1.4
$1N1314: length 11.1
  Top Layer w0.254: 8.68,35.64 9.33,36.29 arc(9.72,36.55) 10.18,36.64 arc(10.85,36.51) 11.41,36.13 15.33,32.21 arc(15.53,31.91) 15.6,31.56 arc(15.5,31.07) 15.23,30.66 R5.2
$1N3593: length 7.1
  Top Layer w0.254: Q1.1 2.97,32.19
$1N4546:
  vias: v1(16.03,5.02) v1(16.03,4.27) v1(16.83,5.02) v1(16.83,4.27) v1(17.61,4.27)

## Copper pours and planes (outline as drawn; the poured copper is in the pictures)
GND on Top Layer: -4.32,49.27 -4.31,49.53 -4.26,49.88 -4.17,50.21 -4.04,50.54 -3.87,50.85 -3.67,51.13 -3.44,51.39 -3.18,51.62 -2.89,51.82 -2.59,51.99 -2.26,52.12 -1.93,52.21 -1.58,52.26 -1.32,52.27 27.6,52.27 27.87,52.26 28.21,52.21 28.55,52.12 28.87,51.99 29.18,51.82 29.47,51.62 29.73,51.39 29.96,51.13 30.16,50.85 30.32,50.54 30.45,50.21 30.54,49.88 30.59,49.53 30.6,49.27 30.6,-1.62 30.59,-1.89 30.54,-2.23 30.45,-2.57 30.32,-2.89 30.16,-3.2 29.96,-3.49 29.73,-3.75 29.47,-3.98 29.18,-4.18 28.87,-4.34 28.55,-4.47 28.21,-4.56 27.87,-4.61 27.6,-4.62 -1.32,-4.62 -1.58,-4.61 -1.93,-4.56 -2.26,-4.47 -2.59,-4.34 -2.89,-4.18 -3.18,-3.98 -3.44,-3.75 -3.67,-3.49 -3.87,-3.2 -4.04,-2.89 -4.17,-2.57 -4.26,-2.23 -4.31,-1.89 -4.32,-1.62
GND on Bottom Layer: -7.36,51.69 33.53,51.69 33.53,-1.53 -7.36,-1.53
SOLAR_VCC on Top Layer: 1.64,28.2 5.16,28.2 5.16,27.05 1.64,27.05
SOLAR_VCC on Bottom Layer: 1.62,28.2 4.55,28.2 4.55,27.05 1.62,27.05
$1N4546 on Top Layer: 14.93,5.4 18.03,5.4 18.03,3.87 14.93,3.87
$1N4546 on Bottom Layer: 15.63,7.57 18.68,7.57 18.68,3.7 15.63,3.7

Small or netless copper shapes (teardrops, artwork), in the pictures only: 25 on Top Layer, 3 on Bottom Layer

## Text on the board
Bottom Solder Mask Layer: Lights turn your         road.
Bottom Silkscreen Layer: OFF | ON | Solar - | Solar + | Version (Beta.3.1) | Solar-Panel / 44 x 24 | + | -
Document Layer: DRC检测的挖槽区域错误可以忽略
Top Solder Mask Layer: Please / don't take / my sunshine / away : )
Top Silkscreen Layer: R=6mm
